# EAGLE design VC8Evrs (EAGLE 6.6.0)
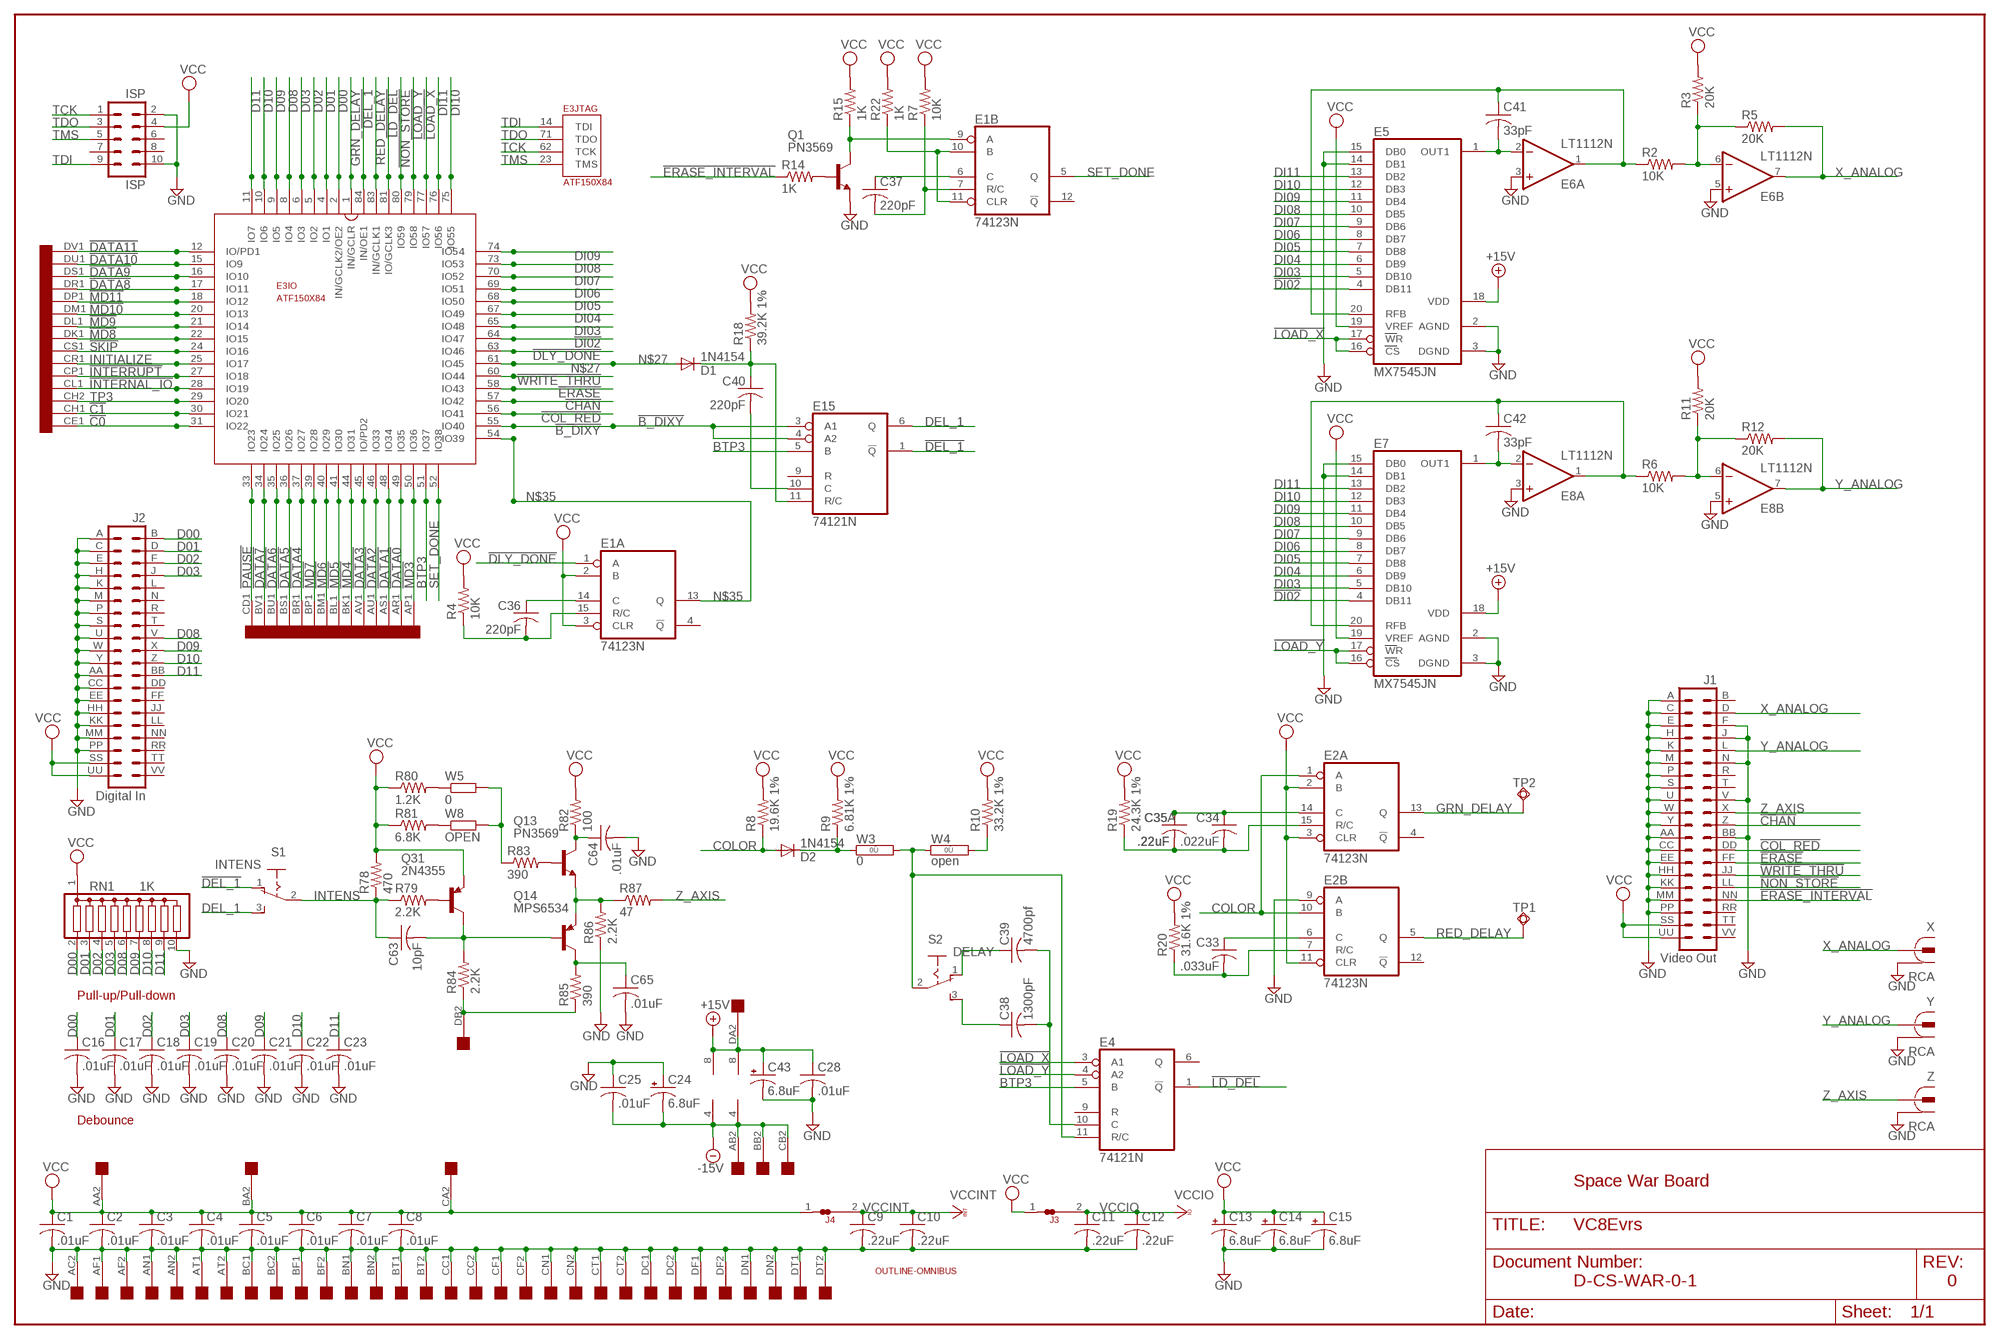
[diagram p0: schematic, sheet 1]

## Parts
C1  .01uF  C-US  [C063-025X075]
C2  .01uF  C-US  [C063-025X075]
C3  .01uF  C-US  [C063-025X075]
C4  .01uF  C-US  [C063-025X075]
C5  .01uF  C-US  [C063-025X075]
C6  .01uF  C-US  [C063-025X075]
C7  .01uF  C-US  [C063-025X075]
C8  .01uF  C-US  [C063-025X075]
C9  .22uF  C-US  [C063-025X075]
C10  .22uF  C-US  [C063-025X075]
C11  .22uF  C-US  [C063-025X075]
C12  .22uF  C-US  [C063-025X075]
C13  6.8uF  CPOL-USE20-8AXIAL  [E12-8]
C14  6.8uF  CPOL-USE20-8AXIAL  [E12-8]
C15  6.8uF  CPOL-USE20-8AXIAL  [E12-8]
C16  .01uF  C-US  [C063-025X075]
C17  .01uF  C-US  [C063-025X075]
C18  .01uF  C-US  [C063-025X075]
C19  .01uF  C-US  [C063-025X075]
C20  .01uF  C-US  [C063-025X075]
C21  .01uF  C-US  [C063-025X075]
C22  .01uF  C-US  [C063-025X075]
C23  .01uF  C-US  [C063-025X075]
C24  6.8uF  CPOL-USE20-8AXIAL  [E12-8]
C25  .01uF  C-US  [C063-025X075]
C28  .01uF  C-US  [C063-025X075]
C33  .033uF  C-US102-043X133  [C102-043X133]
C34  .022uF  C-US102-043X133  [C102-043X133]
C35  .22uF  C-US050-025X075  [C050-025X075]
C35A  .22uF  C-US102-043X133  [C102-043X133]
C36  220pF  C-US  [C063-025X075]
C37  220pF  C-US  [C063-025X075]
C38  1300pF  C-US150-054X183  [C150-054X183]
C39  4700pf  C-US102-043X133  [C102-043X133]
C40  220pF  C-US  [C063-025X075]
C41  33pF  C-US  [C063-025X075]
C42  33pF  C-US  [C063-025X075]
C43  6.8uF  CPOL-USE20-8AXIAL  [E12-8]
C63  10pF  C-US  [C063-025X075]
C64  .01uF  C-US  [C063-025X075]
C65  .01uF  C-US  [C063-025X075]
D1  1N4154  DIODE-DO35-10  [DO35-10]
D2  1N4154  DIODE-DO35-10  [DO35-10]
E1  74123N  [DIL16]
E2  74123N  [DIL16]
E3  ATF150X84  [S84]
E4  74121N  [DIL14]
E5  MX7545JN  [DIL20]
E6  LT1112N  LM1458N  [DIL08]
E7  MX7545JN  [DIL20]
E8  LT1112N  LM1458N  [DIL08]
E15  74121N  [DIL14]
ISP  ISP  ML10  [ML10]
J1  Video Out  DEC40PINH  [DEC40PINH]
J2  Digital In  DEC40PINH  [DEC40PINH]
J3  JUMPER-NC1  [NC1]
J4  JUMPER-NC1  [NC1]
OMNIBUS  QUAD  [EDGE-CON8]
Q1  PN3569  -NPN-TO18-  [TO18-]
Q13  PN3569  -NPN-TO5  [TO5]
Q14  MPS6534  -PNP-TO5  [TO5]
Q31  2N4355  -PNP-TO5  [TO5]
R2  10K  R-US_0207/10  [0207/10]
R3  20K  R-US_0207/10  [0207/10]
R4  10K  R-US_0207/10  [0207/10]
R5  20K  R-US_0207/10  [0207/10]
R6  10K  R-US_0207/10  [0207/10]
R7  10K  R-US_0207/10  [0207/10]
R8  19.6K 1%  R-US_0207/15  [0207/15]
R9  6.81K 1%  R-US_0207/15  [0207/15]
R10  33.2K 1%  R-US_0207/15  [0207/15]
R11  20K  R-US_0207/10  [0207/10]
R12  20K  R-US_0207/10  [0207/10]
R14  1K  R-US_0207/10  [0207/10]
R15  1K  R-US_0207/10  [0207/10]
R18  39.2K 1%  R-US_0207/15  [0207/15]
R19  24.3K 1%  R-US_0207/15  [0207/15]
R20  31.6K 1%  R-US_0207/15  [0207/15]
R22  1K  R-US_0207/10  [0207/10]
R78  470  R-US_0207/10  [0207/10]
R79  2.2K  R-US_0207/10  [0207/10]
R80  1.2K  R-US_0207/10  [0207/10]
R81  6.8K  R-US_0207/10  [0207/10]
R82  100  R-US_0207/10  [0207/10]
R83  390  R-US_0207/10  [0207/10]
R84  2.2K  R-US_0207/10  [0207/10]
R85  390  R-US_0207/10  [0207/10]
R86  2.2K  R-US_0207/10  [0207/10]
R87  47  R-US_0207/10  [0207/10]
RN1  1K  G09R  [SIL10]
S1  INTENS  M251  [M251]
S2  DELAY  M251  [M251]
TP1  TPSQPAD1-17  [P1-17]
TP2  TPSQPAD1-17  [P1-17]
U$1  OUTLINE-OMNIBUS  [OMNIBUS]
W3  0  0R  [0R/10]
W4  open  0R  [0R/10]
W5  0  R-EU_0207/10  [0207/10]
W8  OPEN  R-EU_0207/10  [0207/10]
X  RCA  [RCA]
Y  RCA  [RCA]
Z  RCA  [RCA]

## Nets
!B_DIXY: E3.55(IO:IO40) E15.3(A1) E15.4(A2)
!C0: E3.31(IO:IO22) OMNIBUS.CE1
!C1: E3.30(IO:IO21) OMNIBUS.CH1
!CHAN: E3.57(IO:IO42) J1.Z
!COL_RED: E3.56(IO:IO41) J1.DD
!DATA0: E3.49(IO:IO35) OMNIBUS.AR1
!DATA1: E3.48(IO:IO34) OMNIBUS.AS1
!DATA2: E3.46(IO:IO33) OMNIBUS.AU1
!DATA3: E3.45(IO:IO/PD2) OMNIBUS.AV1
!DATA4: E3.37(IO:IO27) OMNIBUS.BR1
!DATA5: E3.36(IO:IO26) OMNIBUS.BS1
!DATA6: E3.35(IO:IO25) OMNIBUS.BU1
!DATA7: E3.34(IO:IO24) OMNIBUS.BV1
!DATA8: E3.17(IO:IO11) OMNIBUS.DR1
!DATA9: E3.16(IO:IO10) OMNIBUS.DS1
!DATA10: E3.15(IO:IO9) OMNIBUS.DU1
!DATA11: E3.12(IO:IO/PD1) OMNIBUS.DV1
!DEL_1: E3.84(IO:IN/OE1) E15.1(!Q) S1.1(O)
!DI02: E3.64(IO:IO47) E5.4(DB11) E7.4(DB11)
!DLY_DONE: E1.1(A:A) E3.63(IO:IO46)
!ERASE: E3.58(IO:IO43) J1.FF
!ERASE_INTERVAL: J1.NN R14.1
!INTERNAL_IO: E3.28(IO:IO19) OMNIBUS.CL1
!INTERRUPT: E3.27(IO:IO18) OMNIBUS.CP1
!LD_DEL: E3.81(IO:IO/GCLK3) E4.1(!Q)
!LOAD_X: E3.77(IO:IO57) E4.3(A1) E5.16(CS) E5.17(WR)
!LOAD_Y: E3.79(IO:IO58) E4.4(A2) E7.16(CS) E7.17(WR)
!MD3: E3.50(IO:IO36) OMNIBUS.AP1
!MD4: E3.44(IO:IO31) OMNIBUS.BK1
!MD5: E3.41(IO:IO30) OMNIBUS.BL1
!MD6: E3.40(IO:IO29) OMNIBUS.BM1
!MD7: E3.39(IO:IO28) OMNIBUS.BP1
!MD8: E3.22(IO:IO15) OMNIBUS.DK1
!MD9: E3.21(IO:IO14) OMNIBUS.DL1
!MD10: E3.20(IO:IO13) OMNIBUS.DM1
!MD11: E3.18(IO:IO12) OMNIBUS.DP1
!NON_STORE: E3.80(IO:IO59) J1.LL
!PAUSE: E3.33(IO:IO23) OMNIBUS.CD1
!SKIP: E3.24(IO:IO16) OMNIBUS.CS1
!WRITE_THRU: E3.60(IO:IO44) J1.JJ
+15V: C28.1 C43.+ E5.18(VDD) E6.8(P:V+) E7.18(VDD) E8.8(P:V+) OMNIBUS.DA2
-15V [supply]: C24.- C25.2 E6.4(P:V-) E8.4(P:V-) OMNIBUS.AB2 OMNIBUS.BB2 OMNIBUS.CB2
BTP3: E3.51(IO:IO37) E4.5(B) E15.5(B)
COLOR: D2.A E2.1(A:A) E2.10(B:B) R8.1
D00: C16.1 E3.2(IO:IN/GCLK2/OE2) J2.B RN1.2
D01: C17.1 E3.4(IO:IO1) J2.D RN1.3
D02: C18.1 E3.5(IO:IO2) J2.F RN1.4
D03: C19.1 E3.6(IO:IO3) J2.J RN1.5
D08: C20.1 E3.8(IO:IO4) J2.V RN1.6
D09: C21.1 E3.9(IO:IO5) J2.X RN1.7
D10: C22.1 E3.10(IO:IO6) J2.Z RN1.8
D11: C23.1 E3.11(IO:IO7) J2.BB RN1.9
DEL_1: E15.6(Q) S1.3(S)
DI03: E3.65(IO:IO48) E5.5(DB10) E7.5(DB10)
DI04: E3.67(IO:IO49) E5.6(DB9) E7.6(DB9)
DI05: E3.68(IO:IO50) E5.7(DB8) E7.7(DB8)
DI06: E3.69(IO:IO51) E5.8(DB7) E7.8(DB7)
DI07: E3.70(IO:IO52) E5.9(DB6) E7.9(DB6)
DI08: E3.73(IO:IO53) E5.10(DB5) E7.10(DB5)
DI09: E3.74(IO:IO54) E5.11(DB4) E7.11(DB4)
DI10: E3.75(IO:IO55) E5.12(DB3) E7.12(DB3)
DI11: E3.76(IO:IO56) E5.13(DB2) E7.13(DB2)
GND [supply]: C1.2 C2.2 C3.2 C4.2 C5.2 C6.2 C7.2 C8.2 C9.2 C10.2 C11.2 C12.2 C13.- C14.- C15.- C16.2 C17.2 C18.2 C19.2 C20.2 C21.2 C22.2 C23.2 C24.+ C25.1 C28.2 C43.- C64.2 C65.2 E2.9(B:A) E5.2(AGND) E5.3(DGND) E5.14(DB1) E5.15(DB0) E6.3(A:+IN) E6.5(B:+IN) E7.2(AGND) E7.3(DGND) E7.14(DB1) E7.15(DB0) E8.3(A:+IN) E8.5(B:+IN) ISP.2 ISP.10 J1.A J1.AA J1.BB J1.C J1.CC J1.E J1.EE J1.F J1.H J1.HH J1.J J1.K J1.KK J1.M J1.MM J1.N J1.P J1.PP J1.S J1.U J1.V J1.W J1.Y J2.A J2.AA J2.C J2.CC J2.E J2.EE J2.H J2.HH J2.K J2.KK J2.M J2.MM J2.P J2.PP J2.S J2.U J2.W J2.Y OMNIBUS.AC2 OMNIBUS.AF1 OMNIBUS.AF2 OMNIBUS.AN1 OMNIBUS.AN2 OMNIBUS.AT1 OMNIBUS.AT2 OMNIBUS.BC1 OMNIBUS.BC2 OMNIBUS.BF1 OMNIBUS.BF2 OMNIBUS.BN1 OMNIBUS.BN2 OMNIBUS.BT1 OMNIBUS.BT2 OMNIBUS.CC1 OMNIBUS.CC2 OMNIBUS.CF1 OMNIBUS.CF2 OMNIBUS.CN1 OMNIBUS.CN2 OMNIBUS.CT1 OMNIBUS.CT2 OMNIBUS.DC1 OMNIBUS.DC2 OMNIBUS.DF1 OMNIBUS.DF2 OMNIBUS.DN1 OMNIBUS.DN2 OMNIBUS.DT1 OMNIBUS.DT2 Q1.1(E) R86.1 RN1.10 X.1 X.1@1 X.1@2 Y.1 Y.1@1 Y.1@2 Z.1 Z.1@1 Z.1@2
GRN_DELAY: E2.13(A:Q) E3.1(IO:IN/GCLR) TP2.TP
INITIALIZE: E3.25(IO:IO17) OMNIBUS.CR1
INTENS: C63.1 R78.1 R79.1 S1.2(P)
N$1: C41.2 E5.1(OUT1) E6.2(A:-IN)
N$2: E6.6(B:-IN) R2.2 R3.1 R5.1
N$3: C41.1 E5.20(RFB) E6.1(A:OUT) R2.1
N$4: C39.1 S2.1(O)
N$5: C42.2 E7.1(OUT1) E8.2(A:-IN)
N$6: E8.6(B:-IN) R6.2 R11.1 R12.1
N$7: C42.1 E7.20(RFB) E8.1(A:OUT) R6.1
N$27: D1.A E3.61(IO:IO45)
N$28: C40.1 D1.C E15.11(R/C) R18.1
N$29: C40.2 E15.10(C)
N$30: C34.2 C35.2 C35A.2 E2.15(A:R/C) R19.1
N$31: C33.2 E2.7(B:R/C) R20.1
N$32: C33.1 E2.6(B:C)
N$33: C34.1 C35.1 C35A.1 E2.14(A:C)
N$35: E1.13(A:Q) E3.54(IO:IO39)
N$36: C36.2 E1.15(A:R/C) R4.1
N$37: C36.1 E1.14(A:C)
N$38: Q1.2(B) R14.2
N$39: E1.9(B:A) Q1.3(C) R15.1
N$40: E1.10(B:B) E1.11(B:CLR) R22.1
N$41: C37.2 E1.7(B:R/C) R7.1
N$42: C37.1 E1.6(B:C)
N$44: D2.C R9.1 W3.1
N$45: E4.11(R/C) S2.2(P) W3.2 W4.1
N$46: R10.1 W4.2
N$48: C38.1 S2.3(S)
N$49: C38.2 C39.2 E4.10(C)
N$153: Q31.2(B) R79.2
N$154: C63.2 Q14.2(B) Q31.3(C) R84.2
N$155 [supply]: OMNIBUS.DB2 R84.1 R85.1
N$156: C65.1 Q14.3(C) R85.2
N$157: Q13.1(E) Q14.1(E) R86.2 R87.1
N$158: R80.2 W5.1
N$159: R81.2 W8.1
N$160: Q13.2(B) R83.2
N$161: R83.1 W5.2 W8.2
N$162: C64.1 Q13.3(C) R82.1
RED_DELAY: E2.5(B:Q) E3.83(IO:IN/GCLK1) TP1.TP
SET_DONE: E1.5(B:Q) E3.52(IO:IO38)
TCK: E3.62(JTAG:TCK) ISP.1
TDI: E3.14(JTAG:TDI) ISP.9
TDO: E3.71(JTAG:TDO) ISP.3
TMS: E3.23(JTAG:TMS) ISP.5
TP3: E3.29(IO:IO20) OMNIBUS.CH2
VCC [supply]: C1.1 C2.1 C3.1 C4.1 C5.1 C6.1 C7.1 C8.1 C13.+ C14.+ C15.+ E1.2(A:B) E1.3(A:CLR) E2.2(A:B) E2.3(A:CLR) E2.11(B:CLR) E5.19(VREF) E7.19(VREF) ISP.4 J1.SS J1.UU J2.SS J2.UU J3.1 J4.1 OMNIBUS.AA2 OMNIBUS.BA2 OMNIBUS.CA2 Q31.1(E) R3.2 R4.2 R7.2 R8.2 R9.2 R10.2 R11.2 R15.2 R18.2 R19.2 R20.2 R22.2 R78.2 R80.1 R81.1 R82.2 RN1.1
VCCINT [supply]: C9.1 C10.1 J4.2
VCCIO [supply]: C11.1 C12.1 J3.2
X_ANALOG: E6.7(B:OUT) J1.D R5.2 X.2
Y_ANALOG: E8.7(B:OUT) J1.L R12.2 Y.2
Z_AXIS: J1.X R87.2 Z.2
Unconnected: E1.4(A:!Q) E1.12(B:!Q) E2.4(A:!Q) E2.12(B:!Q) E4.6(Q) E4.9(R) E15.9(R) ISP.6 ISP.7 ISP.8 J1.B J1.R J1.RR J1.T J1.TT J1.VV J2.DD J2.FF J2.JJ J2.L J2.LL J2.N J2.NN J2.R J2.RR J2.T J2.TT J2.VV OMNIBUS.AA1 OMNIBUS.AB1 OMNIBUS.AC1 OMNIBUS.AD1 OMNIBUS.AD2 OMNIBUS.AE1 OMNIBUS.AE2 OMNIBUS.AH1 OMNIBUS.AH2 OMNIBUS.AJ1 OMNIBUS.AJ2 OMNIBUS.AK1 OMNIBUS.AK2 OMNIBUS.AL1 OMNIBUS.AL2 OMNIBUS.AM1 OMNIBUS.AM2 OMNIBUS.AP2 OMNIBUS.AR2 OMNIBUS.AS2 OMNIBUS.AU2 OMNIBUS.AV2 OMNIBUS.BA1 OMNIBUS.BB1 OMNIBUS.BD1 OMNIBUS.BD2 OMNIBUS.BE1 OMNIBUS.BE2 OMNIBUS.BH1 OMNIBUS.BH2 OMNIBUS.BJ1 OMNIBUS.BJ2 OMNIBUS.BK2 OMNIBUS.BL2 OMNIBUS.BM2 OMNIBUS.BP2 OMNIBUS.BR2 OMNIBUS.BS2 OMNIBUS.BU2 OMNIBUS.BV2 OMNIBUS.CA1 OMNIBUS.CB1 OMNIBUS.CD2 OMNIBUS.CE2 OMNIBUS.CJ1 OMNIBUS.CJ2 OMNIBUS.CK1 OMNIBUS.CK2 OMNIBUS.CL2 OMNIBUS.CM1 OMNIBUS.CM2 OMNIBUS.CP2 OMNIBUS.CR2 OMNIBUS.CS2 OMNIBUS.CU1 OMNIBUS.CU2 OMNIBUS.CV1 OMNIBUS.CV2 OMNIBUS.DA1 OMNIBUS.DB1 OMNIBUS.DD1 OMNIBUS.DD2 OMNIBUS.DE1 OMNIBUS.DE2 OMNIBUS.DH1 OMNIBUS.DH2 OMNIBUS.DJ1 OMNIBUS.DJ2 OMNIBUS.DK2 OMNIBUS.DL2 OMNIBUS.DM2 OMNIBUS.DP2 OMNIBUS.DR2 OMNIBUS.DS2 OMNIBUS.DU2 OMNIBUS.DV2

## Notes on the sheet
- Pull-up/Pull-down
- Debounce
- Space War Board
- D-CS-WAR-0-1 | 0

## Power pins joined to a net without a drawn wire
GND: E1.8(P:GND) E2.8(P:GND) E3.7(GND) E3.19(GND) E3.32(GND) E3.42(GND) E3.47(GND) E3.59(GND) E3.72(GND) E3.82(GND) E4.7(GND) E15.7(GND)
VCC: E1.16(P:VCC) E2.16(P:VCC) E4.14(VCC) E15.14(VCC)
VCCINT: E3.3(VCCINT) E3.43(VCCINT)
VCCIO: E3.13(VCCIO) E3.26(VCCIO) E3.38(VCCIO) E3.53(VCCIO) E3.66(VCCIO) E3.78(VCCIO)

## Library data of the parts
C1-C12 C16-C23 C25 C28 C36 C37 C40-C42 C63-C65 = dec-con:C-US: Capacitors with funky DEC lead spacing.
C13-C15 C24 C43 = dec-con:CPOL-USE20-8AXIAL: A 0.8 inch electrolytic.
C33-C35 C35A C38 C39 = rcl:C-US: CAPACITOR, American symbol
D1 D2 = diode:DIODE-: DIODE
E1 E2 = 74xx-us:74*123: Retriggerable monostable MULTIVIBRATOR
E3 = atmel-cpld:ATF150X84: ATF150x in 84 pin package.
E4 E15 = 74xx-us:74*121: Monostable MULTIVIBRATOR, schmitt trigger inputs
E5 E7 = maxim:MX7545JN: DIGITAL/ANALOG CONVERTER; MPN: MX7545JN+; OC_FARNELL: unknown; OC_NEWARK: 61K1015
E6 E8 = linear:*1458: OP AMP
ISP = con-harting-ml:ML10: HARTING; OC_FARNELL: unknown; OC_NEWARK: unknown
J1 J2 = dec-con:DEC40PIN: PIN HEADER
J3 J4 = dec-con:JUMPER: Normally closed SMD Jumper (Generates a DRC error.)
OMNIBUS = dec-con:QUAD: Quad-Height DEC board
Q1 Q13 = transistor:*-NPN-: NPN Transistror BF959 corrected 2008.03.06
Q14 Q31 = transistor:*-PNP-: PNP Transistror
R2-R12 R14 R15 R18-R20 R22 R78-R87 = rcl:R-US_: RESISTOR, American symbol
RN1 = resistor-sil:G09R: SIL RESISTOR; OC_FARNELL: unknown; OC_NEWARK: unknown
S1 S2 = switch:M251: SLIDING SWITCH Mors, distributor Buerklin, 11G702
TP1 TP2 = testpad:TPSQ: Test pad
U$1 = dec-con:OUTLINE-*: Board outlines for DEC boards.
W3 W4 = jumper:0R: Bridge 0R 10mm
W5 W8 = rcl:R-EU_: RESISTOR, European symbol
X Y Z = dec-con:RCA: RCA Jack

## Net classes
1 supply: width 0.686 mm

## Board
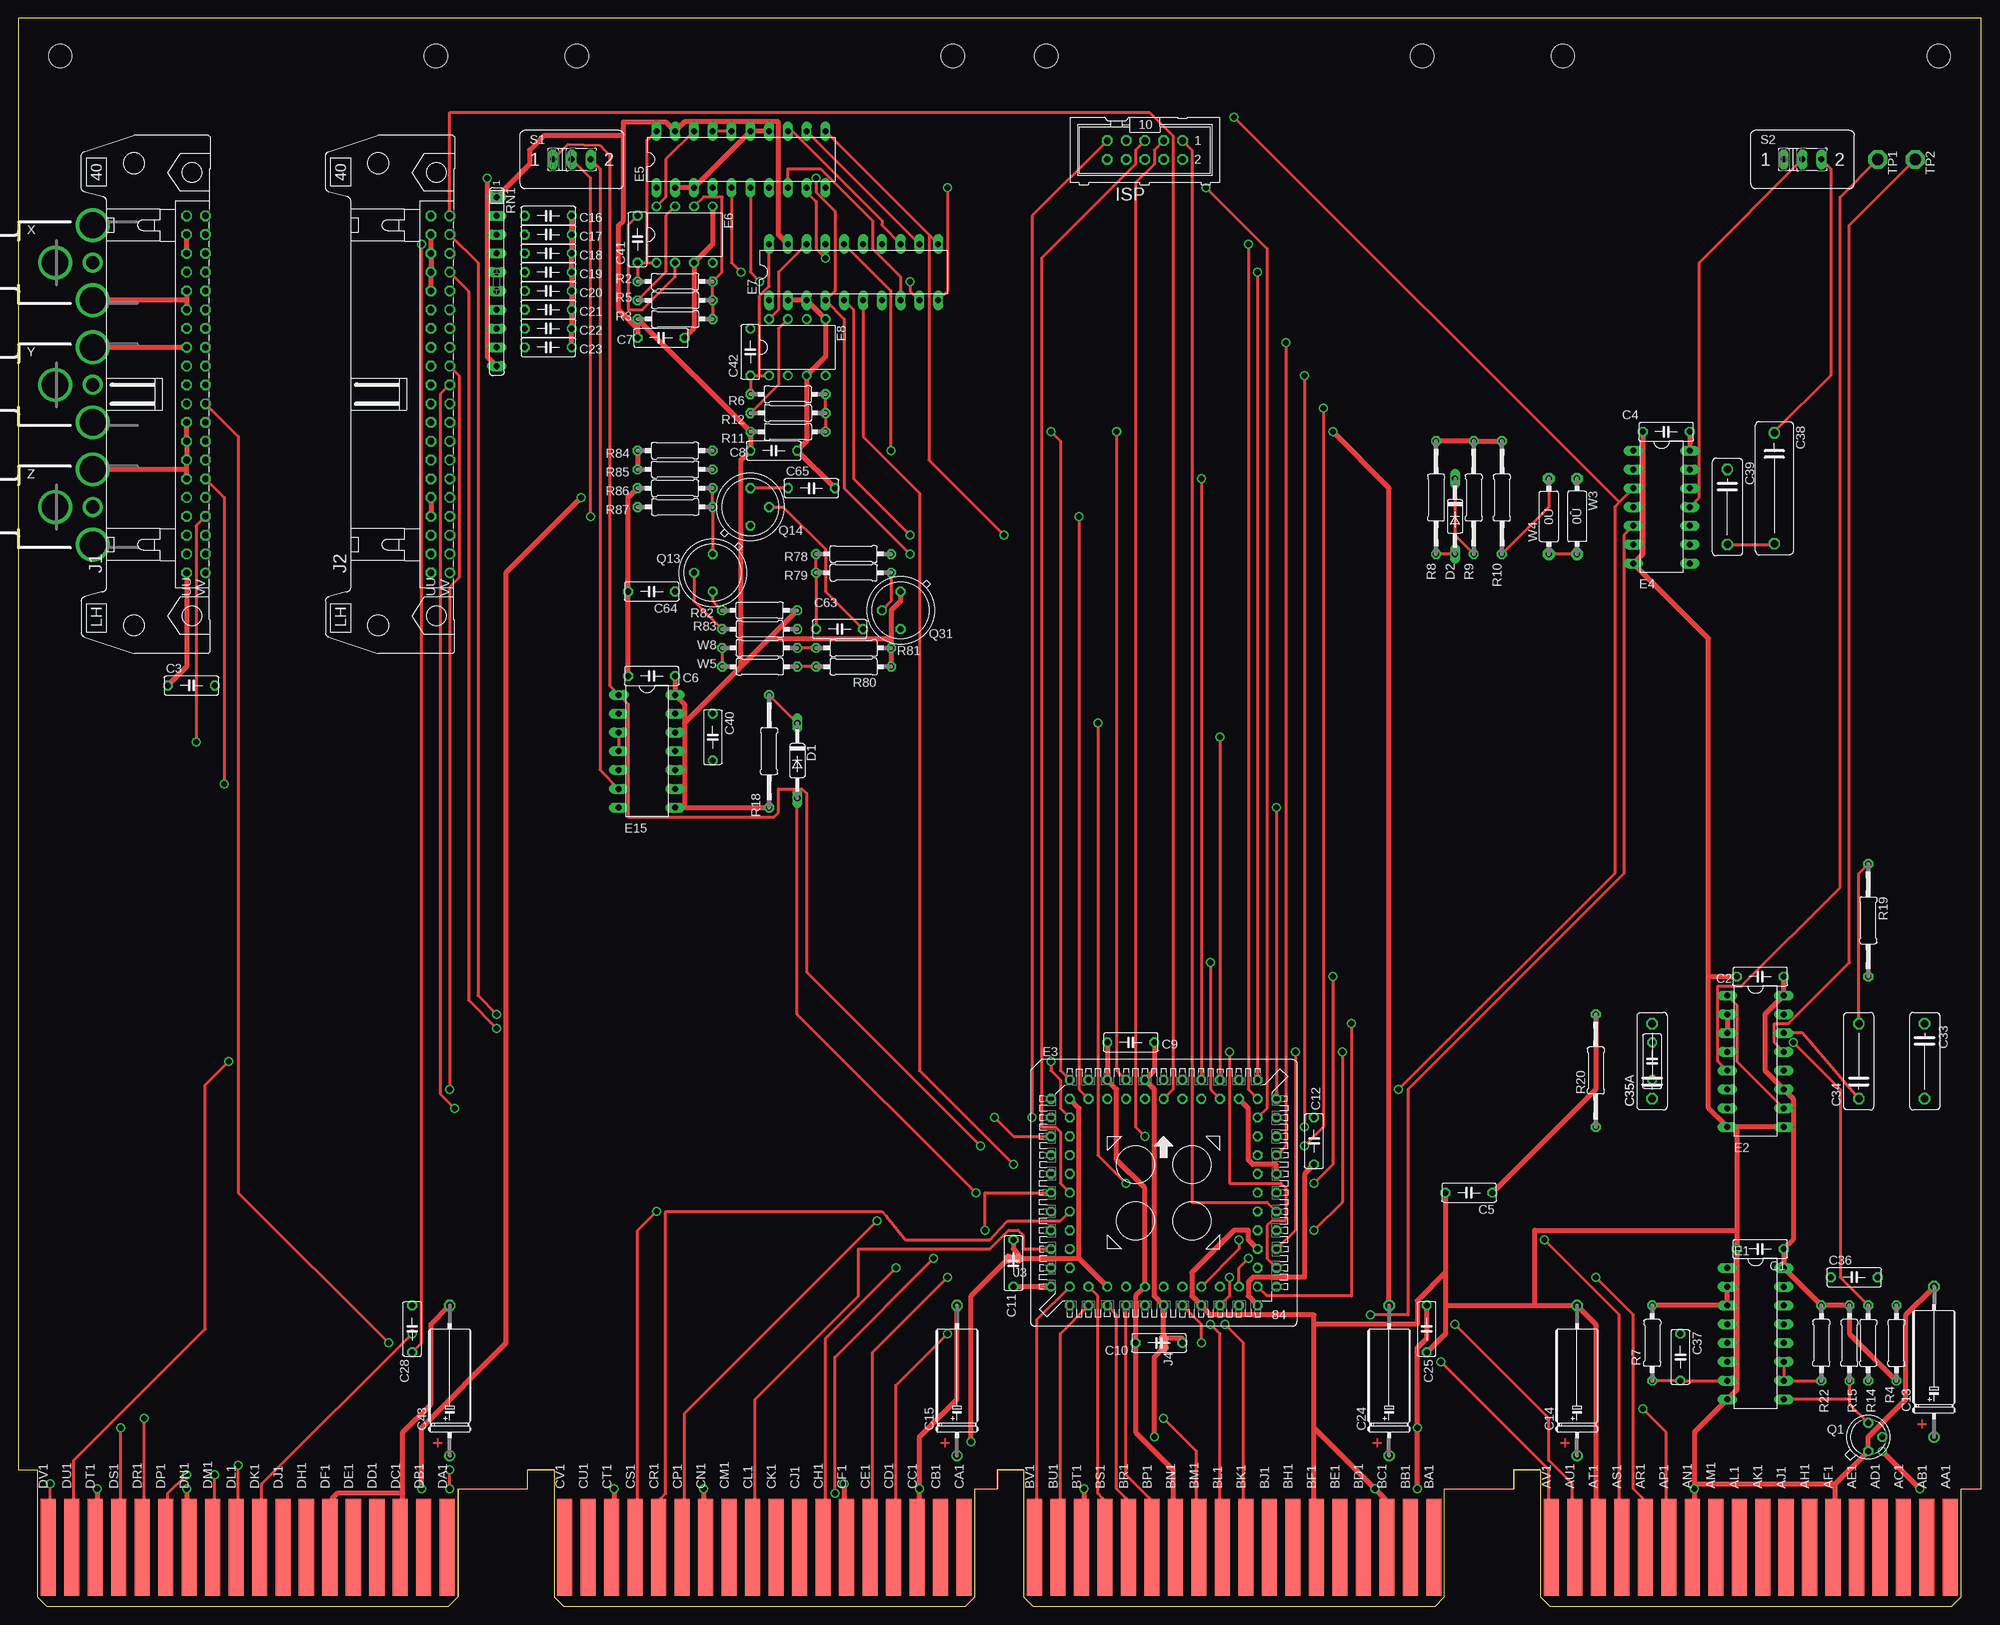
[diagram p1: board, top side]
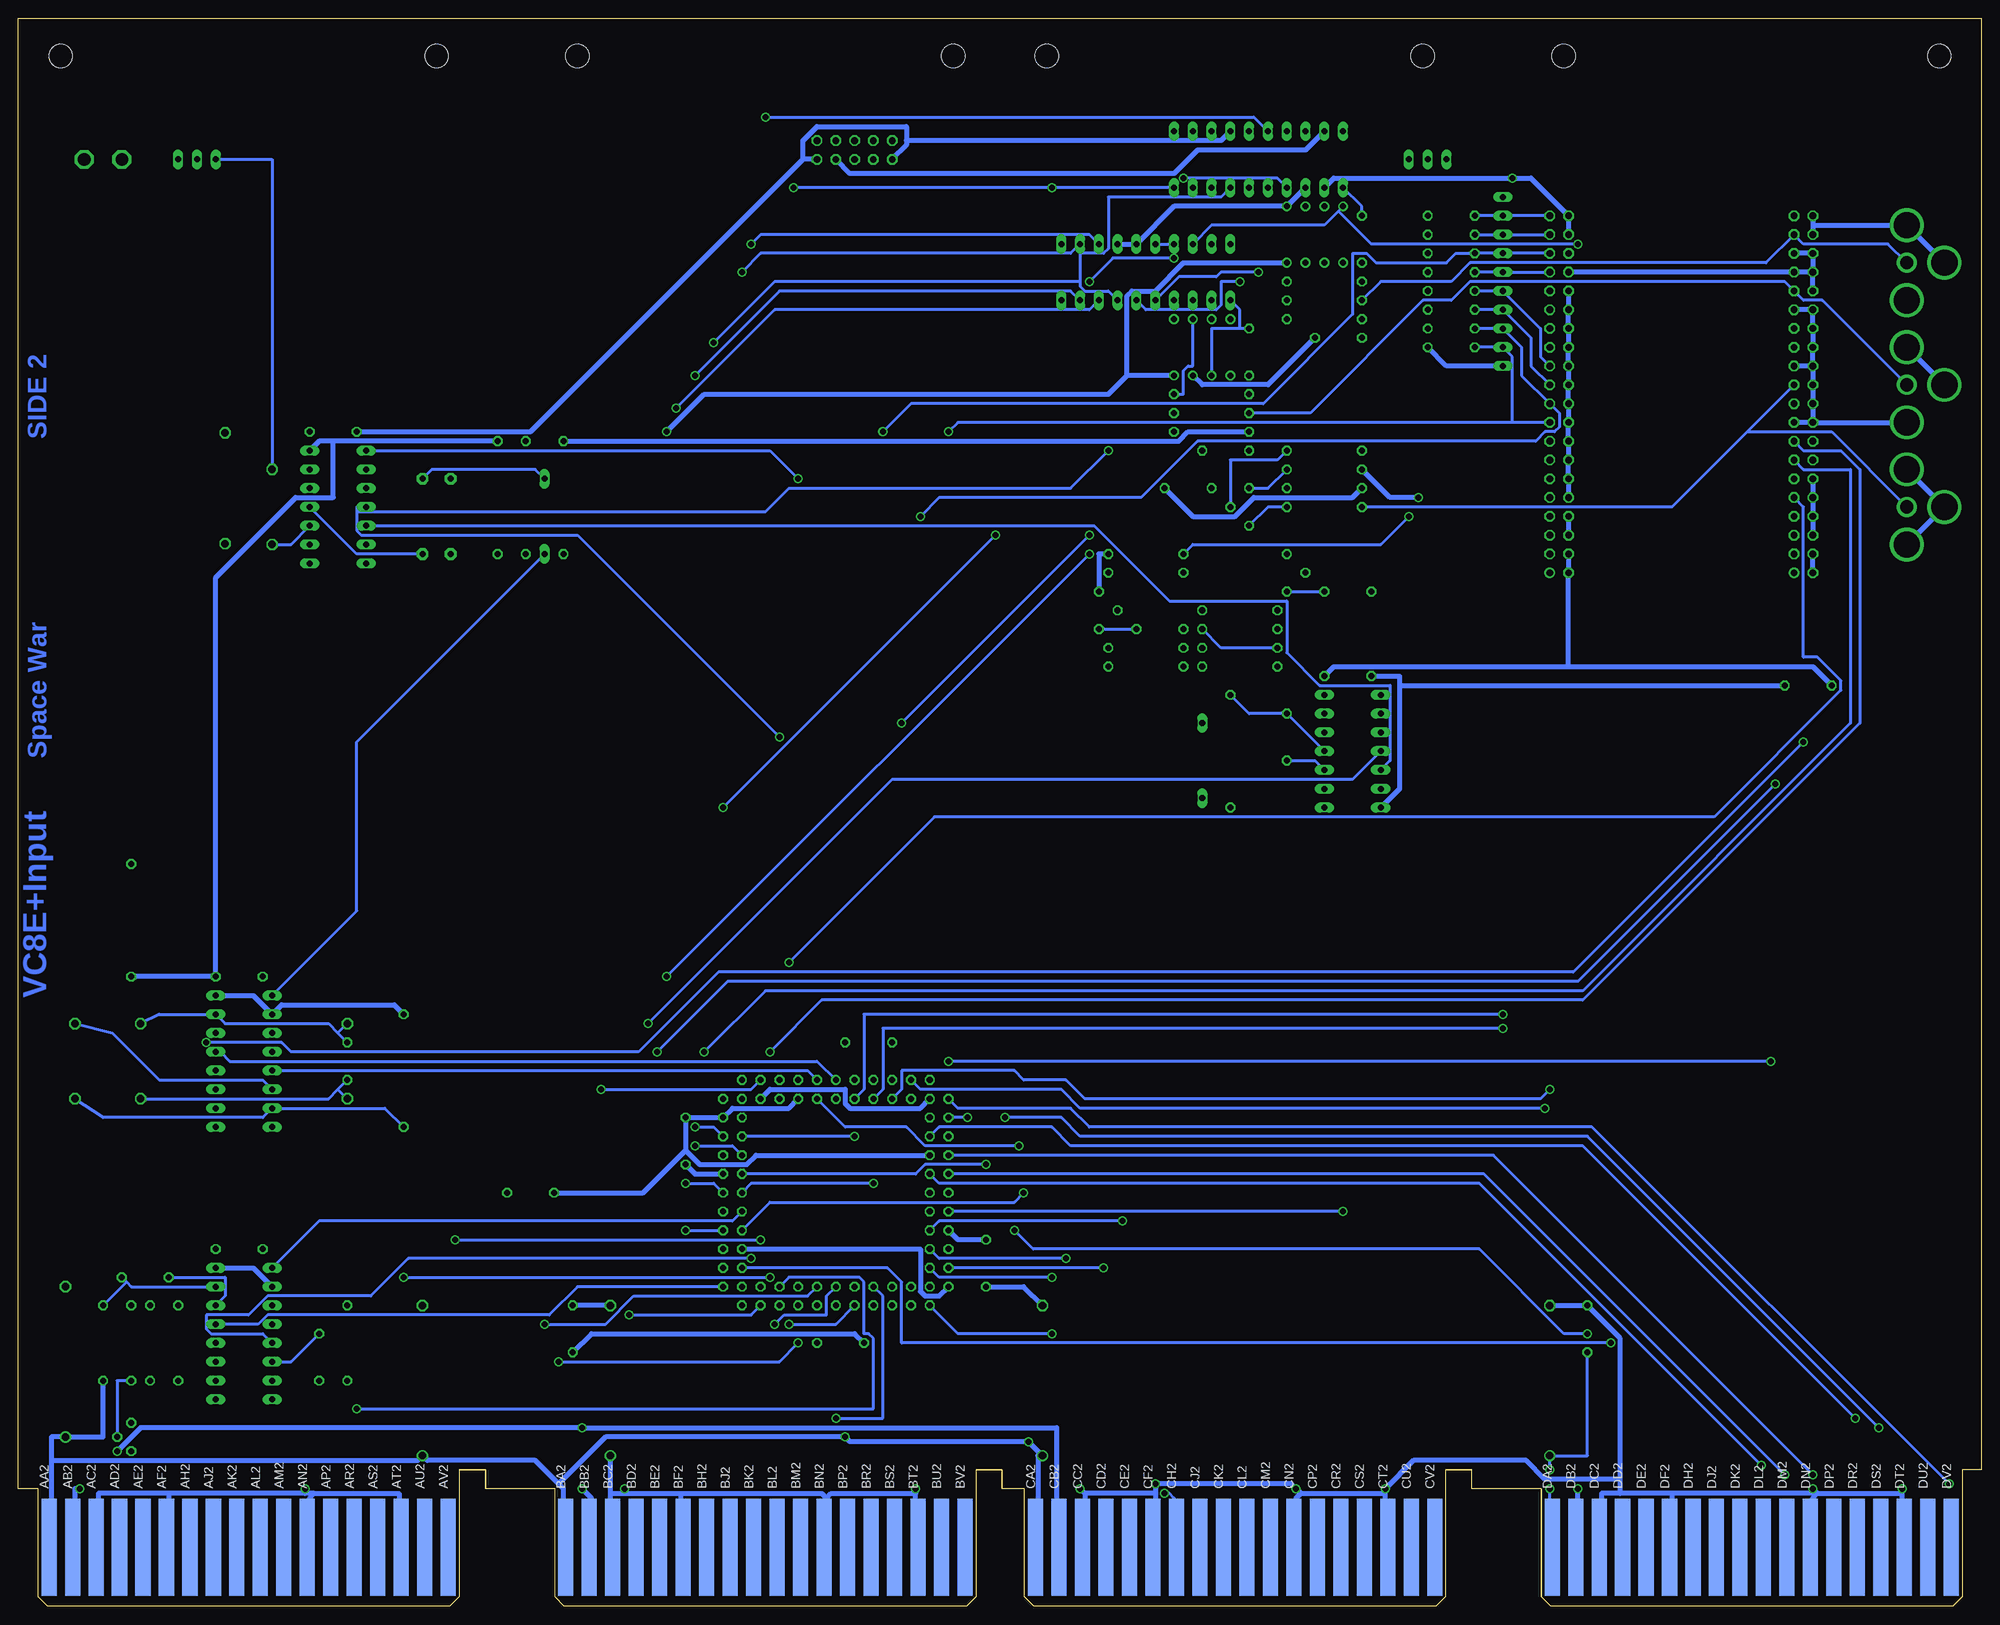
[diagram p2: board, bottom side, seen from below]

Size 265.3 x 214.63 mm. Coordinates in mm from the lower left corner, seen from the top.
Copper layers (1+2+15+16): Top 0.035mm / dielectric 1.5mm / ECO1 0.035mm / dielectric 0.15mm / ECO2 0.035mm / dielectric 0.2mm / Bottom 0.035mm
Design rules "16mils *": minimum track width 16mil, minimum drill 32mil, track to track 12.5mil, track to pad 10mil, pad to pad 10mil, via to via 10mil, smd to smd 10mil, copper to edge 13mil, drill to drill 10mil, minimum pad ring 10mil, minimum via ring 8mil, stop-mask expansion 0mil, vias tented up to drill 0mil, thermal gap 10mil

### Footprints (pad centres in the part's own frame; a part is rotated, then mirrored left to right if it is on the bottom)
C063-025X075 = drill 0.813 octagon: 1 -2.54,0; 2 3.81,0
E12-8 = drill 1.016: + -10.16,0 | drill 1.016 octagon: - 10.16,0
C102-043X133 = drill 1.016 octagon: 1 -5.08,0; 2 5.08,0
C050-025X075 = drill 0.813 octagon: 1 -2.54,0; 2 2.54,0
C150-054X183 = drill 1.016 octagon: 1 -7.493,0; 2 7.493,0
DO35-10 = drill 0.813 long: A 5.08,0; C -5.08,0
DIL16 = drill 0.813 long: 1 -8.89,-3.81; 2 -6.35,-3.81; 3 -3.81,-3.81; 4 -1.27,-3.81; 5 1.27,-3.81; 6 3.81,-3.81; 7 6.35,-3.81; 8 8.89,-3.81; 9 8.89,3.81; 10 6.35,3.81; 11 3.81,3.81; 12 1.27,3.81; 13 -1.27,3.81; 14 -3.81,3.81; 15 -6.35,3.81; 16 -8.89,3.81
S84 = drill 0.813: 1 0,15.24 | drill 0.813 octagon: 2 0,12.7; 3 -2.54,15.24; 4 -2.54,12.7; 5 -5.08,15.24; 6 -5.08,12.7; 7 -7.62,15.24; 8 -7.62,12.7; 9 -10.16,15.24; 10 -10.16,12.7; 11 -12.7,15.24; 12 -15.24,12.7; 13 -12.7,12.7; 14 -15.24,10.16; 15 -12.7,10.16; 16 -15.24,7.62; 17 -12.7,7.62; 18 -15.24,5.08; 19 -12.7,5.08; 20 -15.24,2.54; 21 -12.7,2.54; 22 -15.24,0; 23 -12.7,0; 24 -15.24,-2.54; 25 -12.7,-2.54; 26 -15.24,-5.08; 27 -12.7,-5.08; 28 -15.24,-7.62; 29 -12.7,-7.62; 30 -15.24,-10.16; 31 -12.7,-10.16; 32 -15.24,-12.7; 33 -12.7,-15.24; 34 -12.7,-12.7; 35 -10.16,-15.24; 36 -10.16,-12.7; 37 -7.62,-15.24; 38 -7.62,-12.7; 39 -5.08,-15.24; 40 -5.08,-12.7; 41 -2.54,-15.24; 42 -2.54,-12.7; 43 0,-15.24; 44 0,-12.7; 45 2.54,-15.24; 46 2.54,-12.7; 47 5.08,-15.24; 48 5.08,-12.7; 49 7.62,-15.24; 50 7.62,-12.7; 51 10.16,-15.24; 52 10.16,-12.7; 53 12.7,-15.24; 54 15.24,-12.7; 55 12.7,-12.7; 56 15.24,-10.16; 57 12.7,-10.16; 58 15.24,-7.62; 59 12.7,-7.62; 60 15.24,-5.08; 61 12.7,-5.08; 62 15.24,-2.54; 63 12.7,-2.54; 64 15.24,0; 65 12.7,0; 66 15.24,2.54; 67 12.7,2.54; 68 15.24,5.08; 69 12.7,5.08; 70 15.24,7.62; 71 12.7,7.62; 72 15.24,10.16; 73 12.7,10.16; 74 15.24,12.7; 75 12.7,15.24; 76 12.7,12.7; 77 10.16,15.24; 78 10.16,12.7; 79 7.62,15.24; 80 7.62,12.7; 81 5.08,15.24; 82 5.08,12.7; 83 2.54,15.24; 84 2.54,12.7
DIL14 = drill 0.813 long: 1 -7.62,-3.81; 2 -5.08,-3.81; 3 -2.54,-3.81; 4 0,-3.81; 5 2.54,-3.81; 6 5.08,-3.81; 7 7.62,-3.81; 8 7.62,3.81; 9 5.08,3.81; 10 2.54,3.81; 11 0,3.81; 12 -2.54,3.81; 13 -5.08,3.81; 14 -7.62,3.81
DIL20 = drill 0.813 long: 1 -11.43,-3.81; 2 -8.89,-3.81; 3 -6.35,-3.81; 4 -3.81,-3.81; 5 -1.27,-3.81; 6 1.27,-3.81; 7 3.81,-3.81; 8 6.35,-3.81; 9 8.89,-3.81; 10 11.43,-3.81; 11 11.43,3.81; 12 8.89,3.81; 13 6.35,3.81; 14 3.81,3.81; 15 1.27,3.81; 16 -1.27,3.81; 17 -3.81,3.81; 18 -6.35,3.81; 19 -8.89,3.81; 20 -11.43,3.81
DIL08 = drill 0.813 pad 1.27: 1 -3.81,-3.81; 2 -1.27,-3.81; 3 1.27,-3.81; 4 3.81,-3.81; 5 3.81,3.81; 6 1.27,3.81; 7 -1.27,3.81; 8 -3.81,3.81
ML10 = drill 0.914 octagon: 1 -5.08,-1.27; 2 -5.08,1.27; 3 -2.54,-1.27; 4 -2.54,1.27; 5 0,-1.27; 6 0,1.27; 7 2.54,-1.27; 8 2.54,1.27; 9 5.08,-1.27; 10 5.08,1.27
DEC40PINH = drill 0.914 octagon: A 24.13,1.27; AA -3.81,1.27; B 24.13,-1.27; BB -3.81,-1.27; C 21.59,1.27; CC -6.35,1.27; D 21.59,-1.27; DD -6.35,-1.27; E 19.05,1.27; EE -8.89,1.27; F 19.05,-1.27; FF -8.89,-1.27; H 16.51,1.27; HH -11.43,1.27; J 16.51,-1.27; JJ -11.43,-1.27; K 13.97,1.27; KK -13.97,1.27; L 13.97,-1.27; LL -13.97,-1.27; M 11.43,1.27; MM -16.51,1.27; N 11.43,-1.27; NN -16.51,-1.27; P 8.89,1.27; PP -19.05,1.27; R 8.89,-1.27; RR -19.05,-1.27; S 6.35,1.27; SS -21.59,1.27; T 6.35,-1.27; TT -21.59,-1.27; U 3.81,1.27; UU -24.13,1.27; V 3.81,-1.27; W 1.27,1.27; X 1.27,-1.27; Y -1.27,1.27; Z -1.27,-1.27 | drill 0.914: VV -24.13,-1.27
NC1 = smd 1.346 x 1.346: 1 -0.635,0; 2 0.635,0
EDGE-CON8 = smd 2.032 x 13.106: AA1 261.303,7.938; AB1 258.127,7.938; AC1 254.952,7.938; AD1 251.778,7.938; AE1 248.602,7.938; AF1 245.428,7.938; AH1 242.252,7.938; AJ1 239.077,7.938; AK1 235.903,7.938; AL1 232.727,7.938; AM1 229.553,7.938; AN1 226.377,7.938; AP1 223.202,7.938; AR1 220.028,7.938; AS1 216.852,7.938; AT1 213.678,7.938; AU1 210.502,7.938; AV1 207.327,7.938; BA1 191.452,7.938; BB1 188.278,7.938; BC1 185.102,7.938; BD1 181.928,7.938; BE1 178.752,7.938; BF1 175.577,7.938; BH1 172.403,7.938; BJ1 169.227,7.938; BK1 166.053,7.938; BL1 162.877,7.938; BM1 159.702,7.938; BN1 156.528,7.938; BP1 153.352,7.938; BR1 150.178,7.938; BS1 147.002,7.938; BT1 143.827,7.938; BU1 140.653,7.938; BV1 137.477,7.938; CA1 127.953,7.938; CB1 124.778,7.938; CC1 121.603,7.938; CD1 118.427,7.938; CE1 115.252,7.938; CF1 112.078,7.938; CH1 108.903,7.938; CJ1 105.728,7.938; CK1 102.552,7.938; CL1 99.377,7.938; CM1 96.203,7.938; CN1 93.028,7.938; CP1 89.853,7.938; CR1 86.677,7.938; CS1 83.502,7.938; CT1 80.328,7.938; CU1 77.153,7.938; CV1 73.978,7.938; DA1 58.102,7.938; DB1 54.928,7.938; DC1 51.752,7.938; DD1 48.578,7.938; DE1 45.403,7.938; DF1 42.227,7.938; DH1 39.053,7.938; DJ1 35.877,7.938; DK1 32.703,7.938; DL1 29.527,7.938; DM1 26.352,7.938; DN1 23.177,7.938; DP1 20.003,7.938; DR1 16.828,7.938; DS1 13.652,7.938; DT1 10.477,7.938; DU1 7.303,7.938; DV1 4.128,7.938 | smd 2.032 x 13.106 bottom: AA2 261.303,7.938; AB2 258.127,7.938; AC2 254.952,7.938; AD2 251.778,7.938; AE2 248.602,7.938; AF2 245.428,7.938; AH2 242.252,7.938; AJ2 239.077,7.938; AK2 235.903,7.938; AL2 232.727,7.938; AM2 229.553,7.938; AN2 226.377,7.938; AP2 223.202,7.938; AR2 220.028,7.938; AS2 216.852,7.938; AT2 213.678,7.938; AU2 210.502,7.938; AV2 207.327,7.938; BA2 191.452,7.938; BB2 188.278,7.938; BC2 185.102,7.938; BD2 181.928,7.938; BE2 178.752,7.938; BF2 175.577,7.938; BH2 172.403,7.938; BJ2 169.227,7.938; BK2 166.053,7.938; BL2 162.877,7.938; BM2 159.702,7.938; BN2 156.528,7.938; BP2 153.352,7.938; BR2 150.178,7.938; BS2 147.002,7.938; BT2 143.827,7.938; BU2 140.653,7.938; BV2 137.477,7.938; CA2 127.953,7.938; CB2 124.778,7.938; CC2 121.603,7.938; CD2 118.427,7.938; CE2 115.252,7.938; CF2 112.078,7.938; CH2 108.903,7.938; CJ2 105.728,7.938; CK2 102.552,7.938; CL2 99.377,7.938; CM2 96.203,7.938; CN2 93.028,7.938; CP2 89.853,7.938; CR2 86.677,7.938; CS2 83.502,7.938; CT2 80.328,7.938; CU2 77.153,7.938; CV2 73.978,7.938; DA2 58.102,7.938; DB2 54.928,7.938; DC2 51.752,7.938; DD2 48.578,7.938; DE2 45.403,7.938; DF2 42.227,7.938; DH2 39.053,7.938; DJ2 35.877,7.938; DK2 32.703,7.938; DL2 29.527,7.938; DM2 26.352,7.938; DN2 23.177,7.938; DP2 20.003,7.938; DR2 16.828,7.938; DS2 13.652,7.938; DT2 10.477,7.938; DU2 7.303,7.938; DV2 4.128,7.938
TO18- = drill 0.813 octagon: 1 1.905,0; 2 0,1.905; 3 -1.905,0
TO5 = drill 0.813 octagon: 1 0,-2.54; 2 2.54,0; 3 0,2.54
0207/10 = drill 0.813 octagon: 1 -5.08,0; 2 5.08,0
0207/15 = drill 0.813 octagon: 1 -7.62,0; 2 7.62,0
SIL10 = drill 0.813 long: 1 -11.43,0; 2 -8.89,0; 3 -6.35,0; 4 -3.81,0; 5 -1.27,0; 6 1.27,0; 7 3.81,0; 8 6.35,0; 9 8.89,0; 10 11.43,0
M251 = drill 0.813 long: 1 -2.54,0; 2 0,0; 3 2.54,0
P1-17 = drill 1.702 pad 2.54 octagon: TP 0,0
OMNIBUS = hole 3.175: 208.915,209.55; 259.715,209.55; 189.865,209.55; 139.065,209.55; 75.616,209.55; 126.416,209.55; 56.566,209.55; 5.766,209.55
0R/10 = drill 0.813 pad 1.6 octagon: 1 -5.08,0; 2 5.08,0
RCA = drill 3.556: 1 -5.08,0; 1@1 0,-5.08; 1@2 0,5.08 | drill 1.8: 2 0,0

### Placement (x,y rotation side)
C1  236.09,48.26 180 top
C2  236.09,85.09 180 top
C3  22.73,124.46 0 top
C4  223.39,158.75 180 top
C5  196.72,55.88 180 top
C6  86.23,125.73 180 top
C7  86.23,171.45 0 top
C8  101.47,156.21 0 top
C9  151,76.2 180 top
C10  154.81,35.56 180 top
C11  134.49,46.99 270 top
C12  175.13,62.23 90 top
C13  258.95,33.02 90 top
C14  210.69,30.48 90 top
C15  126.87,30.48 90 top
C16  70.99,187.96 0 top
C17  70.99,185.42 0 top
C18  70.99,182.88 0 top
C19  70.99,180.34 0 top
C20  70.99,177.8 0 top
C21  70.99,175.26 0 top
C22  70.99,172.72 0 top
C23  70.99,170.18 0 top
C24  185.29,30.48 90 top
C25  190.37,36.83 90 top
C28  53.21,36.83 90 top
C33  257.68,73.66 270 top
C34  248.79,73.66 90 top
C35  220.85,73.66 90 top
C35A  220.85,73.66 90 top
C36  247.52,44.45 0 top
C37  224.66,34.29 270 top
C38  237.36,151.13 270 top
C39  231.01,148.59 270 top
C40  93.85,118.11 270 top
C41  83.69,184.15 90 top
C42  98.93,168.91 90 top
C43  58.29,30.48 90 top
C63  110.36,132.08 0 top
C64  86.23,137.16 180 top
C65  106.55,151.13 0 top
D1  105.28,114.3 270 top
D2  194.18,147.32 270 top
E1  234.82,36.83 270 top
E2  234.82,73.66 270 top
E3  154.81,55.88 0 top
E4  222.12,148.59 270 top
E5  97.66,195.58 0 top
E6  90.04,185.42 0 top
E7  112.9,180.34 0 top
E8  105.28,170.18 0 top
E15  84.96,115.57 270 top
ISP  152.27,196.85 180 top
J1  24,163.83 90 top
J2  57.02,163.83 90 top
J3  134.49,46.99 0 top
J4  154.81,35.56 90 top
OMNIBUS  -0.13,0 0 top
Q1  250.06,22.86 270 top
Q13  93.85,139.7 180 top
Q14  98.93,148.59 0 top
Q31  119.25,134.62 180 top
R2  88.77,179.07 0 top
R3  88.77,173.99 180 top
R4  253.87,35.56 270 top
R5  88.77,176.53 180 top
R6  104.01,163.83 0 top
R7  220.85,35.56 90 top
R8  191.64,149.86 90 top
R9  196.72,149.86 90 top
R10  200.53,149.86 90 top
R11  104.01,158.75 180 top
R12  104.01,161.29 180 top
R14  250.06,35.56 270 top
R15  247.52,35.56 90 top
R18  101.47,115.57 270 top
R19  250.06,92.71 270 top
R20  213.23,72.39 90 top
R22  243.71,35.56 90 top
R78  112.9,142.24 0 top
R79  112.9,139.7 0 top
R80  112.9,127 180 top
R81  112.9,129.54 180 top
R82  100.2,134.62 0 top
R83  100.2,132.08 180 top
R84  88.77,156.21 0 top
R85  88.77,153.67 0 top
R86  88.77,151.13 0 top
R87  88.77,148.59 180 top
RN1  64.64,179.07 270 top
S1  74.8,195.58 0 top
S2  241.17,195.58 0 top
TP1  251.33,195.58 270 top
TP2  256.41,195.58 270 top
U$1  -0.13,0 0 top
W3  210.69,147.32 270 top
W4  206.88,147.32 90 top
W5  100.2,127 180 top
W8  100.2,129.54 180 top
X  10.03,181.61 0 top
Y  10.03,165.1 0 top
Z  10.03,148.59 0 top

### Tracks (layer width: path | path; a pad name or v marks a point on that pad's centre or on a via)
!B_DIXY  (via drill 0.81)
  Top 0.406: E15.3 E15.4 | E3.55 168.78,41.91 180.21,41.91 v180.21,78.74
  Bottom 0.406: v180.21,78.74 147.19,111.76 84.96,111.76 E15.4
!C0  (via drill 0.81)
  Top 0.406: v125.6,44.45 115.44,34.29 115.44,8.26 OMNIBUS.CE1
  Bottom 0.406: E3.31 140.84,44.45 v125.6,44.45
!C1  (via drill 0.81)
  Top 0.406: v118.62,45.72 109.09,36.2 109.09,8.26 OMNIBUS.CH1
  Bottom 0.406: v118.62,45.72 E3.30
!CHAN  (via drill 0.81)
  Top 0.406: v50.04,35.56 29.72,55.88 29.72,158.12 J1.Z
  Bottom 0.406: E3.57 147.83,45.72 145.92,43.81 145.92,35.56 v50.04,35.56
!COL_RED  (via drill 0.81)
  Top 0.406: E3.56 168.78,46.99 168.78,51.44 169.42,52.07 171.32,52.07 171.32,56.52 170.69,57.15 163.7,57.15 v163.7,74.93
  Bottom 0.406: v163.7,74.93 156.72,81.92 53.85,81.92 16.38,119.38 16.38,153.67 18.92,156.21 24,156.21 J1.DD
!DATA0  (via drill 0.81)
  Top 0.406: E3.49 163.7,41.91 v163.7,44.45 | v213.23,44.45 218.31,39.37 218.31,15.88 219.58,14.61 219.58,8.26 OMNIBUS.AR1
  Bottom 0.406: v213.23,44.45 v163.7,44.45
!DATA1  (via drill 0.81)
  Top 0.406: E3.48 164.97,48.26 v164.97,49.53 | v206.25,49.53 216.41,39.37 216.41,8.26 OMNIBUS.AS1
  Bottom 0.406: v206.25,49.53 v164.97,49.53
!DATA2  (via drill 0.81)
  Top 0.406: v194.18,38.1 206.88,25.4 206.88,19.68 210.06,16.51 210.06,8.26 OMNIBUS.AU1
  Bottom 0.406: E3.46 158.62,41.91 182.12,41.91 185.93,38.1 v194.18,38.1
!DATA3  (via drill 0.81)
  Top 0.406: E3.45 159.89,38.1 v159.89,35.56 | v192.28,33.02 206.88,18.41 206.88,8.26 OMNIBUS.AV1
  Bottom 0.406: v159.89,35.56 162.43,33.02 v192.28,33.02
!DATA4
  Top 0.406: E3.37 148.46,39.37 148.46,15.88 149.73,14.61 149.73,8.26 OMNIBUS.BR1
!DATA5
  Top 0.406: E3.36 145.92,41.91 145.92,15.24 146.56,14.61 146.56,8.26 OMNIBUS.BS1
!DATA6
  Top 0.406: E3.35 140.84,36.83 140.84,8.26 OMNIBUS.BU1
!DATA7
  Top 0.406: E3.34 137.67,38.73 137.67,8.26 OMNIBUS.BV1
!DATA8  (via drill 0.81)
  Top 0.406: v17.02,25.4 17.02,8.26 OMNIBUS.DR1
  Bottom 0.406: E3.17 140.84,64.77 125.6,64.77 123.06,62.23 53.85,62.23 v17.02,25.4
!DATA9  (via drill 0.81)
  Top 0.406: E3.16 134.49,63.5 v131.95,66.04 | v13.84,24.13 13.84,8.26 OMNIBUS.DS1
  Bottom 0.406: v131.95,66.04 124.33,66.04 121.79,63.5 53.21,63.5 v13.84,24.13
!DATA10  (via drill 0.81)
  Top 0.406: E3.15 140.84,67.31 140.84,71.12 139.57,72.39 v139.57,73.66 | v28.45,73.66 25.27,70.48 25.27,37.47 7.49,19.68 7.49,8.26 OMNIBUS.DU1
  Bottom 0.406: v28.45,73.66 v139.57,73.66
!DATA11  (via drill 0.81)
  Top 0.406: v4.32,16.51 4.32,8.26 OMNIBUS.DV1
  Bottom 0.406: E3.12 138.3,67.31 123.06,67.31 120.52,64.77 52.58,64.77 v4.32,16.51
!DEL_1  (via drill 0.81)
  Top 0.406: S1.1 74.3,197.61 78.61,197.49 79.88,196.09 79.88,124.46 E15.1 82.42,121.92 82.42,106.68 102.11,106.68 102.74,107.31 102.74,110.49 105.92,110.49 106.55,109.86 106.55,85.72 v130.05,62.23
  Bottom 0.406: E3.84 153.54,64.77 145.29,64.77 142.75,62.23 v130.05,62.23
!DI02  (via drill 0.81)
  Top 0.406: v107.82,193.04 107.82,191.13 110.36,188.59 110.36,177.8 E7.4 111.63,173.99 111.63,151.13 v120.52,142.24 | v175.13,57.15 177.67,59.69 v177.67,85.09
  Bottom 0.406: v107.82,193.04 95.12,193.04 E5.4 | E3.64 171.32,57.15 v175.13,57.15 | v120.52,142.24 v177.67,85.09
!DLY_DONE
  Bottom 0.406: E1.1 224.66,52.07 168.78,52.07 E3.63
!ERASE  (via drill 0.81)
  Top 0.406: E3.58 172.59,50.8 v172.59,74.93
  Bottom 0.406: v172.59,74.93 164.34,83.19 53.85,83.19 17.65,119.38 17.65,153.67 24,153.67 J1.FF
!ERASE_INTERVAL  (via drill 0.81)
  Top 0.406: R14.1 246.25,44.45 246.25,69.85 v239.9,76.2 | v24,116.84 24,146.05 J1.NN
  Bottom 0.406: v239.9,76.2 229.74,76.2 228.47,74.93 181.48,74.93 170.69,85.72 55.12,85.72 v24,116.84
!INTERNAL_IO
  Top 0.406: E3.28 135.76,48.26 135.76,50.16 135.13,50.8 133.86,50.8 131.32,48.26 113.54,48.26 113.54,41.91 99.57,27.94 99.57,8.26 OMNIBUS.CL1
!INTERRUPT  (via drill 0.81)
  Top 0.406: v116.08,52.07 90.04,26.04 90.04,8.26 OMNIBUS.CP1
  Bottom 0.406: E3.27 140.84,52.07 v116.08,52.07
!LD_DEL  (via drill 0.81)
  Top 0.406: v159.89,152.4 E3.81
  Bottom 0.406: v159.89,152.4 163.7,156.21 E4.1
!LOAD_X  (via drill 0.81)
  Top 0.406: E5.16 E5.17 | v186.56,69.85 215.77,99.06 215.77,148.59 216.41,149.22 | E4.3 216.41,149.22 | 216.41,149.22 v164.34,201.29
  Bottom 0.406: E3.77 166.24,69.85 v186.56,69.85 | E5.16 98.3,201.29 v164.34,201.29
!LOAD_Y  (via drill 0.81)
  Top 0.406: v162.43,117.47 E3.79 | E7.16 117.98,177.8 v117.98,156.21
  Bottom 0.406: E7.16 E7.17 | v162.43,117.47 189.74,144.78 218.95,144.78 219.58,145.41 219.58,147.96 | 219.58,147.96 219.58,148.59 E4.4 | v117.98,156.21 123.06,151.13 161.16,151.13 164.34,147.96 219.58,147.96
!MD3  (via drill 0.81)
  Top 0.406: v219.58,26.67 222.76,23.5 222.76,8.26 OMNIBUS.AP1
  Bottom 0.406: E3.50 161.16,44.45 151.64,44.45 151,43.81 151,36.83 150.37,36.83 149.73,36.2 149.73,26.67 v219.58,26.67
!MD4  (via drill 0.81)
  Top 0.406: v163.07,38.1 165.61,35.56 165.61,8.26 OMNIBUS.BK1
  Bottom 0.406: E3.44 156.08,41.91 156.08,39.37 161.8,39.37 v163.07,38.1
!MD5  (via drill 0.81)
  Top 0.406: v161.16,38.1 162.43,36.83 162.43,8.26 OMNIBUS.BL1
  Bottom 0.406: E3.41 154.81,38.1 v161.16,38.1
!MD6  (via drill 0.81)
  Top 0.406: v154.81,25.4 159.26,20.95 159.26,8.26 OMNIBUS.BM1
  Bottom 0.406: E3.40 148.46,41.91 148.46,25.4 v154.81,25.4
!MD7
  Top 0.406: E3.39 149.73,17.78 152.91,14.61 152.91,8.26 OMNIBUS.BP1
!MD8  (via drill 0.81)
  Top 0.406: E3.22 130.68,55.88 v130.68,50.8 | v53.21,36.83 32.89,16.51 32.89,8.26 OMNIBUS.DK1
  Bottom 0.406: v130.68,50.8 128.14,48.26 67.82,48.26 56.39,36.83 v53.21,36.83
!MD9  (via drill 0.81)
  Top 0.406: v29.72,19.05 29.72,8.26 OMNIBUS.DL1
  Bottom 0.406: E3.21 140.84,57.15 67.82,57.15 v29.72,19.05
!MD10  (via drill 0.81)
  Top 0.406: v26.54,17.78 26.54,8.26 OMNIBUS.DM1
  Bottom 0.406: E3.20 67.18,58.42 v26.54,17.78
!MD11  (via drill 0.81)
  Top 0.406: v22.73,17.78 20.19,15.24 20.19,8.26 OMNIBUS.DP1
  Bottom 0.406: E3.18 65.91,60.96 v22.73,17.78
!NON_STORE  (via drill 0.81)
  Top 0.406: E3.80 161.16,69.85 v161.16,87
  Bottom 0.406: v161.16,87 141.48,106.68 36.07,106.68 18.92,123.83 18.92,125.09 22.1,128.27 24,128.27 24,148.59 J1.LL
!PAUSE  (via drill 0.81)
  Top 0.406: v125.6,36.83 118.62,29.84 118.62,8.26 OMNIBUS.CD1
  Bottom 0.406: E3.33 138.3,36.83 v125.6,36.83
!SKIP  (via drill 0.81)
  Top 0.406: v86.23,53.34 83.69,50.8 83.69,8.26 OMNIBUS.CS1
  Bottom 0.406: v86.23,53.34 E3.24
!WRITE_THRU  (via drill 0.81)
  Top 0.406: v175.13,50.8 178.94,54.61 v178.94,74.93 | v27.81,111.12 27.81,149.86 J1.JJ
  Bottom 0.406: v175.13,50.8 E3.60 | v178.94,74.93 169.42,84.45 54.48,84.45 v27.81,111.12
+15V  (via drill 0.81)
  Top 0.406: E8.8 102.74,175.26 102.74,180.34 E7.18 | E6.8 87.5,190.5 87.5,195.58 E5.18 | v58.29,15.88 v58.29,18.41 | v54.48,184.15 54.48,35.56 C28.1
  Bottom 0.406: E7.18 104.01,186.69 88.77,186.69 86.87,188.59 | E6.8 86.87,188.59 | C28.1 53.21,20.32 C43.+ v58.29,18.41 | v58.29,15.88 58.29,8.26 OMNIBUS.DA2 | 86.87,188.59 82.42,184.15 v54.48,184.15
-15V  (via drill 0.81)
  Top 0.686: C25.2 190.37,36.2 189.1,34.92 v189.1,24.13 v189.1,15.88 | v251.97,20.95 v257.05,15.88 | v177.67,158.75 185.29,151.13 C24.-
  Bottom 0.686: E6.4 107.82,181.61 111.63,177.8 114.81,177.8 115.44,177.16 115.44,166.37 | E8.4 115.44,166.37 | C24.- C25.2 | v189.1,15.88 187.83,14.61 187.83,8.26 OMNIBUS.BB2 | OMNIBUS.CB2 124.97,8.26 124.97,24.13 v189.1,24.13 248.79,24.13 v251.97,20.95 | v257.05,15.88 257.68,15.88 257.68,8.26 OMNIBUS.AB2 | 115.44,166.37 117.98,163.83 172.59,163.83 v177.67,158.75
BTP3  (via drill 0.81)
  Top 0.406: v182.75,39.37 187.83,39.37 187.83,69.85 217.04,99.06 217.04,144.78 E4.5
  Bottom 0.406: E15.5 79.88,114.3 79.88,124.46 89.41,124.46 93.85,128.91 93.85,135.89 109.73,135.89 119.89,146.05 E4.5 | E3.51 166.24,39.37 v182.75,39.37
COLOR
  Top 0.406: D2.A R8.1 | E2.10 232.28,73.66 232.28,81.28 E2.1
  Bottom 0.406: D2.A 219.58,116.84 219.58,93.98 E2.1
D00
  Top 0.406: E3.2 156.08,69.85 156.08,198.75 152.91,201.93 58.29,201.93 J2.B
  Bottom 0.406: J2.B RN1.2 C16.1
D01  (via drill 0.81)
  Top 0.406: v64.64,80.01 62.1,82.55 62.1,181.61 J2.D
  Bottom 0.406: E3.4 151,69.85 151,80.01 v64.64,80.01 | J2.D RN1.3 C17.1
D02  (via drill 0.81)
  Top 0.406: E3.5 148.46,72.39 v148.46,158.75
  Bottom 0.406: v148.46,158.75 144.65,162.56 97.03,162.56 84.96,174.62 84.96,182.88 83.06,182.88 81.79,181.61 72.26,181.61 70.99,182.88 C18.1 RN1.4 J2.F
D03  (via drill 0.81)
  Top 0.406: v64.64,78.11 60.83,81.92 60.83,177.8 J2.J
  Bottom 0.406: E3.6 148.46,69.85 148.46,78.11 v64.64,78.11 | J2.J RN1.5 C19.1
D08  (via drill 0.81)
  Top 0.406: v58.29,69.85 58.29,137.79 59.56,139.06 59.56,166.37 J2.V
  Bottom 0.406: E3.8 145.92,69.85 145.92,72.39 130.68,72.39 129.41,71.12 123.7,71.12 121.16,68.58 59.56,68.58 v58.29,69.85 | J2.V 59.56,168.91 59.56,172.72 RN1.6 C20.1
D09  (via drill 0.81)
  Top 0.406: v58.93,67.31 57.02,69.22 57.02,163.83 J2.X
  Bottom 0.406: E3.9 143.38,69.85 124.33,69.85 121.79,67.31 v58.93,67.31 | J2.X 60.83,167.64 60.83,171.45 RN1.7 C21.1
D10  (via drill 0.81)
  Top 0.406: E3.10 143.38,69.85 v143.38,147.32
  Bottom 0.406: v143.38,147.32 140.84,149.86 113.54,149.86 105.92,157.48 60.2,157.48 58.93,158.75 57.66,158.75 57.02,159.38 57.02,161.29 J2.Z 62.1,166.37 62.1,170.18 RN1.8 C22.1
D11  (via drill 0.81)
  Top 0.406: E3.11 140.84,72.39 140.84,157.48 v139.57,158.75
  Bottom 0.406: v139.57,158.75 138.3,160.02 63.37,160.02 | J2.BB 63.37,160.02 | 63.37,160.02 63.37,168.91 RN1.9 C23.1
DEL_1
  Top 0.406: E15.6 78.61,113.03 78.61,194.31 S1.3
DI03  (via drill 0.81)
  Top 0.406: v97.66,180.34 96.39,181.61 E5.5 | v149.73,57.15 145.92,60.96 v145.92,119.38 | v120.52,144.78 112.9,152.4 112.9,175.26 E7.5
  Bottom 0.406: E7.5 108.46,179.71 103.38,179.71 102.74,180.34 v97.66,180.34 | E3.65 166.24,57.15 v149.73,57.15 | v120.52,144.78 v145.92,119.38
DI04  (via drill 0.81)
  Top 0.406: v100.2,179.07 98.93,180.34 E5.6 | v134.49,59.69 121.79,72.39 121.79,150.5 114.17,158.12 E7.6
  Bottom 0.406: E7.6 112.9,175.26 103.38,175.26 102.74,175.9 102.74,179.07 v100.2,179.07 | E3.67 144.02,58.42 142.75,59.69 v134.49,59.69
DI05  (via drill 0.81)
  Top 0.406: E3.68 171.32,62.23 v171.32,170.81
  Bottom 0.406: E7.7 117.98,177.8 121.16,177.8 121.79,178.44 121.79,179.07 | 121.79,179.07 121.79,182.88 118.62,182.88 117.98,183.51 117.98,190.5 102.74,190.5 E5.7 | v171.32,170.81 163.07,179.07 121.79,179.07
DI06  (via drill 0.81)
  Top 0.406: E7.8 119.25,179.71 115.44,183.51 115.44,187.32 108.46,194.31 104.01,194.31 E5.8 | v173.86,62.23 176.4,64.77 v176.4,161.93
  Bottom 0.406: E3.69 168.78,62.23 v173.86,62.23 | v176.4,161.93 163.07,175.26 120.52,175.26 E7.8
DI07  (via drill 0.81)
  Top 0.406: E7.9 120.52,177.8 v120.52,179.07 | v109.09,182.25 107.82,183.51 107.82,189.87 106.55,191.13 E5.9 | v173.86,166.37 v173.86,64.77
  Bottom 0.406: v120.52,179.07 117.35,182.25 v109.09,182.25 | E3.70 171.32,64.77 v173.86,64.77 | v173.86,166.37 162.43,177.8 123.06,177.8 E7.9
DI08  (via drill 0.81)
  Top 0.406: E7.10 125.6,177.8 v125.6,191.77 | E3.73 168.78,67.31 168.78,183.51 v160.53,191.77
  Bottom 0.406: E5.10 v125.6,191.77 v160.53,191.77
DI09  (via drill 0.81)
  Top 0.406: E5.11 123.06,185.42 | 123.06,185.42 E7.11 | v170.05,107.95 E3.74 | v133.22,144.78 123.06,154.94 123.06,185.42
  Bottom 0.406: v133.22,144.78 v170.05,107.95
DI10  (via drill 0.81)
  Top 0.406: E5.12 E7.12 | v167.51,180.34 E3.75
  Bottom 0.406: v167.51,180.34 164.97,182.88 123.06,182.88 E7.12
DI11  (via drill 0.81)
  Top 0.406: E7.13 116.71,186.69 116.71,187.32 104.65,199.39 E5.13 | E3.76 166.24,69.85 v166.24,184.15
  Bottom 0.406: v166.24,184.15 164.97,185.42 120.52,185.42 E7.13
GND  (via drill 0.81)
  Top 0.686: C6.2 C64.2 82.42,149.86 R86.1 | J2.KK J2.MM | J2.K J2.H J2.E J2.C | J1.HH 22.73,153.67 | 22.73,153.67 J1.EE J1.CC J1.AA | J1.E J1.C | J1.K 22.73,176.53 | 22.73,176.53 J1.M | C65.2 C8.2 106.55,157.48 E8.3 109.09,168.91 E8.5 E7.3 E7.2 | C7.2 91.31,172.72 E6.3 93.85,184.15 E6.5 | E5.14 E5.15 E5.3 E5.2 | 245.62,16.51 Q1.1 250.06,22.86 255.14,27.94 255.14,39.37 C13.- | 245.62,16.51 245.62,8.26 OMNIBUS.AF2 | C4.2 219.58,142.24 E4.7 228.47,130.81 228.47,85.09 | E2.9 232.28,64.77 | 232.28,64.77 E2.8 228.47,67.31 228.47,85.09 | 228.47,85.09 C2.2 | 232.28,64.77 232.28,50.8 | 232.28,50.8 C1.2 232.28,29.21 E1.8 226.57,23.5 226.57,16.51 | 226.57,16.51 v226.57,15.88 226.57,8.26 OMNIBUS.AN2 | 226.57,16.51 245.62,16.51 | v80.52,15.88 80.52,8.26 OMNIBUS.CT2 | v92.58,15.88 92.58,8.26 OMNIBUS.CN1 | v111.63,16.51 111.63,8.26 OMNIBUS.CF1 | C43.- 55.75,38.1 55.75,27.3 51.94,23.5 51.94,15.24 | 51.94,15.24 51.94,8.26 OMNIBUS.DC1 | 51.94,15.24 43.05,15.24 42.42,14.61 42.42,8.26 OMNIBUS.DF2 | v10.67,15.88 10.67,8.26 OMNIBUS.DT2 | v22.73,15.88 22.73,8.26 OMNIBUS.DN2 | v144.02,15.88 144.02,8.26 OMNIBUS.BT2 | E3.32 C11.2 | C15.- 126.87,27.94 121.79,22.86 v121.79,15.88 121.79,8.26 OMNIBUS.CC1 | E3.59 166.24,49.53 166.24,50.8 164.34,50.8 158.62,45.09 158.62,41.91 E3.47 161.16,39.37 175.13,39.37 175.13,38.1 | 175.13,24.13 175.13,8.26 OMNIBUS.BF2 | 175.13,24.13 175.13,38.1 | 175.13,24.13 v183.39,15.88 184.66,14.61 184.66,8.26 OMNIBUS.BC1 | C9.2 E3.7 148.46,69.85 148.46,60.33 152.27,56.52 E3.42 151,41.91 C10.2 151,23.5 156.08,18.41 156.08,8.26 OMNIBUS.BN2 | C25.1 192.91,36.83 192.91,40.64 | C5.2 192.91,45.09 | 192.91,45.09 192.91,40.64
  Top 0.686: 192.91,40.64 204.98,40.64 | 204.98,40.64 C14.- 213.23,38.1 213.23,8.26 OMNIBUS.AT2 | 175.13,38.1 189.1,38.1 189.1,41.27 192.91,45.09 | 232.28,50.8 204.98,50.8 204.98,40.64 | RN1.10 63.37,168.91 v63.37,193.04 | C23.2 C22.2 C21.2 C20.2 C19.2 C18.2 C17.2 C16.2 | Y.1@2 J1.S | 22.73,176.53 X.1@1 | 22.73,153.67 Z.1@2
  Bottom 0.686: E15.7 78.61,110.49 78.61,124.46 | 78.61,124.46 78.61,125.73 C6.2 | 78.61,124.46 C3.2 | J2.C J2.A 60.83,193.04 v63.37,193.04 87.5,193.04 E5.2 | J2.K J2.M J2.P J2.S J2.U J2.W J2.Y J2.AA J2.CC J2.EE J2.HH J2.KK | J2.MM J2.PP | J1.AA J1.Y J1.W J1.U | J1.AA J1.BB | J1.PP J1.MM J1.KK J1.HH | J1.A 22.73,186.69 | 22.73,186.69 J1.C | J1.H J1.E J1.F | J1.H J1.J J2.H | J1.N J1.M J1.P J1.S J1.U | J1.U J1.V | J1.K J1.H | ISP.10 145.29,197.49 145.29,198.12 | 145.29,198.12 145.29,200.03 157.35,200.03 159.26,198.12 159.26,195.58 | ISP.2 159.26,195.58 | E7.14 E7.15 109.09,189.23 E6.5 E5.3 | 145.29,198.12 102.74,198.12 E5.14 | E8.3 105.28,165.1 96.39,165.1 C7.2 | R86.1 84.96,149.86 98.3,149.86 100.84,147.32 106.55,147.32 C65.2 | 225.3,15.24 213.87,15.24 213.87,8.26 OMNIBUS.AT2 | 225.3,15.24 225.93,14.61 225.93,8.26 OMNIBUS.AN2 | 244.98,15.24 244.98,8.26 OMNIBUS.AF2 | 225.3,15.24 226.57,15.24 | 226.57,15.24 244.98,15.24 | 244.98,15.24 254.51,15.24 254.51,8.26 OMNIBUS.AC2 | v226.57,15.88 226.57,15.24 | 80.52,15.24 80.52,8.26 OMNIBUS.CT2 | 80.52,15.24 v80.52,15.88 76.71,19.68 61.47,19.68 58.93,17.14 48.77,17.14 | 91.95,15.24 80.52,15.24 | 91.95,15.24 92.58,14.61 92.58,8.26 OMNIBUS.CN1 | 91.95,15.24 v92.58,15.88 93.22,16.51 v111.63,16.51 111.63,15.24 | 111.63,15.24 111.63,8.26 OMNIBUS.CF1 | 121.16,15.24 121.16,8.26 OMNIBUS.CC1 | 111.63,15.24 121.16,15.24 | C43.- C28.2 48.77,36.2 48.77,17.14 | 10.67,15.24 10.67,8.26 OMNIBUS.DT2 | 10.67,15.24 v10.67,15.88 | 22.1,15.24 10.67,15.24 | 22.1,15.24 22.73,14.61 22.73,8.26 OMNIBUS.DN2 | 22.1,15.24 v22.73,15.88 | 41.78,15.24 41.78,8.26 OMNIBUS.DF2 | 22.1,15.24 41.78,15.24 | 41.78,15.24 48.77,15.24
  Bottom 0.686: 48.77,15.24 51.31,15.24 51.31,8.26 OMNIBUS.DC1 | 48.77,15.24 48.77,17.14 | 144.02,15.24 144.02,8.26 OMNIBUS.BT2 | 144.02,15.24 v144.02,15.88 | 144.02,15.24 155.45,15.24 156.08,14.61 | 156.08,14.61 156.08,8.26 OMNIBUS.BN2 | 185.29,15.24 185.29,8.26 OMNIBUS.BC1 | 185.29,15.24 C24.+ | 175.77,15.24 175.77,8.26 OMNIBUS.BF2 | 185.29,15.24 183.39,15.24 | 183.39,15.24 175.77,15.24 | 156.08,14.61 156.72,15.24 175.77,15.24 | C15.- 129.41,43.18 C11.2 | E3.32 140.84,41.91 142.75,41.91 143.38,42.55 143.38,48.26 E3.59 | v183.39,15.88 183.39,15.24 | E3.19 165.61,60.96 166.88,59.69 173.23,59.69 175.13,61.59 | 175.13,61.59 C12.2 E3.72 168.78,67.31 161.16,67.31 E3.82 | 175.13,61.59 180.85,55.88 C5.2 | C10.2 152.27,36.83 187.83,36.83 C25.1 | v121.79,15.88 121.16,15.24 | 159.26,195.58 196.09,158.75 C4.2 | RN1.10 72.26,167.64 C23.2 | X.1 X.1@2 22.73,186.69 | Z.1@2 Z.1 Z.1@1 | Y.1@2 Y.1 | J1.AA Y.1@1
GRN_DELAY
  Top 0.406: TP2.TP 247.52,186.69 247.52,87 239.27,78.74 237.36,78.74 237.36,76.2 E2.13
  Bottom 0.406: E3.1 157.35,73.66 236.73,73.66 238,74.93 E2.13
INITIALIZE
  Top 0.406: E3.25 140.84,52.07 133.73,52.07 131.95,50.16 131.32,49.53 119.89,49.53 117.35,52.7 116.71,53.34 87.5,53.34 87.5,15.24 86.87,14.61 86.87,8.26 OMNIBUS.CR1
INTENS  (via drill 0.81)
  Top 0.406: C63.1 R79.1 R78.1 | S1.2 77.34,193.04 v77.34,147.32
  Bottom 0.406: v77.34,147.32 81.15,143.51 106.55,143.51 R78.1
N$1
  Top 0.406: E6.2 88.77,179.71 84.33,175.26 82.42,175.26 82.42,186.69 C41.2
  Bottom 0.406: E5.1 83.69,189.23 C41.2
N$2
  Top 0.406: R3.1 R5.1 R2.2 95.12,180.34 95.12,190.5 92.58,190.5 E6.6
N$3
  Top 0.406: R2.1 C41.1 84.96,181.61 | 84.96,181.61 E6.1 | E5.20 84.96,198.12 84.96,181.61
N$4
  Bottom 0.406: C39.1 231.01,195.58 S2.1
N$5
  Bottom 0.406: E8.2 104.01,172.72 100.2,172.72 | C42.2 100.2,172.72 | E7.1 100.2,175.26 100.2,172.72
N$6
  Top 0.406: R11.1 R12.1 R6.2
  Bottom 0.406: E8.6 106.55,167.64 107.19,167.64 107.82,167 107.82,163.83 R6.2
N$7
  Top 0.406: R6.1 C42.1 100.2,166.37 | 100.2,166.37 E8.1 | E7.20 101.47,178.44 100.2,177.16 100.2,166.37
N$27  (via drill 0.81)
  Top 0.406: D1.A 105.28,80.01 v129.41,55.88
  Bottom 0.406: v129.41,55.88 130.68,54.61 163.7,54.61 E3.61
N$28
  Top 0.406: R18.1 D1.C
  Bottom 0.406: E15.11 C40.1 98.93,120.65 R18.1
N$29
  Bottom 0.406: E15.10 90.04,114.3 C40.2
N$30
  Top 0.406: R19.1 248.79,99.06 C34.2
  Bottom 0.406: C34.2 246.25,80.01 E2.15 237.36,78.74 223.39,78.74 222.12,77.47 | 222.12,77.47 C35.2 | 222.12,77.47 C35A.2
N$31
  Bottom 0.406: R20.1 215.77,67.31 E2.7 232.28,66.04 253.87,66.04 C33.2
N$32
  Bottom 0.406: E2.6 232.28,71.12 246.25,71.12 252.6,77.47 C33.1
N$33
  Top 0.406: E2.14 241.17,77.47 C34.1
  Bottom 0.406: C34.1 223.39,68.58 222.12,69.85 | 222.12,69.85 C35.1 | 222.12,69.85 C35A.1
N$35
  Bottom 0.406: E1.13 232.92,38.1 231.65,39.37 193.55,39.37 189.74,43.18 E3.54
N$36
  Bottom 0.406: E1.15 250.06,43.18 250.7,43.81 | C36.2 250.7,43.81 | 250.7,43.81 R4.1
N$37
  Bottom 0.406: E1.14 237.36,41.91 237.36,44.45 C36.1
N$38
  Bottom 0.406: Q1.2 251.97,30.48 R14.2
N$39
  Top 0.406: 247.52,27.94 E1.9 | R15.1 247.52,27.94 | Q1.3 247.52,27.3 247.52,27.94
N$40
  Top 0.406: E1.11 E1.10 R22.1
N$41
  Top 0.406: R7.1 C37.2 E1.7
N$42
  Bottom 0.406: C37.1 228.47,33.02 E1.6
N$44
  Top 0.406: R9.1 194.18,144.78 D2.C
  Bottom 0.406: W3.1 209.42,153.67 195.45,153.67 D2.C
N$45
  Top 0.406: W3.2 W4.1 | S2.2 227.2,181.61 227.2,149.86 E4.11
  Bottom 0.406: E4.11 219.58,142.24 W3.2
N$46
  Top 0.406: R10.1 206.88,148.59 W4.2
N$48
  Top 0.406: C38.1 237.36,158.75 244.98,166.37 244.98,194.31 S2.3
N$49
  Top 0.406: C39.2 237.36,143.51 C38.2
  Bottom 0.406: E4.10 228.47,143.51 C39.2
N$153
  Top 0.406: Q31.2 117.98,135.89 R79.2
N$154
  Top 0.406: C63.2 109.09,137.16 109.09,142.88 103.38,148.59 Q14.2
  Bottom 0.406: Q31.3 C63.2 | Q14.2 101.47,154.94 95.12,154.94 R84.2
N$155  (via drill 0.81)
  Top 0.686: R84.1 R85.1 | v76.07,149.86 65.91,139.7 65.91,35.56 54.48,24.13 v54.48,15.88
  Bottom 0.686: R85.1 79.88,149.86 v76.07,149.86 | v54.48,15.88 54.48,8.26 OMNIBUS.DB2
N$156
  Top 0.406: C65.1 Q14.3
  Bottom 0.406: R85.2 96.39,151.13 Q14.3
N$157
  Top 0.406: Q13.1 R87.1 R86.2
  Bottom 0.406: Q14.1 96.39,148.59 R87.1
N$158
  Top 0.406: R80.2 W5.1
N$159
  Top 0.406: R81.2 W8.1
N$160
  Top 0.406: R83.2 91.31,135.89 Q13.2
N$161
  Top 0.406: W8.2 W5.2
  Bottom 0.406: R83.1 102.74,129.54 W8.2
N$162
  Top 0.406: R82.1 93.85,135.89 Q13.3
  Bottom 0.406: Q13.3 C64.1
RED_DELAY
  Top 0.406: TP1.TP 246.25,190.5 246.25,97.16 232.92,83.82 229.74,83.82 229.74,73.66 E2.5
  Bottom 0.406: E3.83 158.62,72.39 E2.5
SET_DONE  (via drill 0.81)
  Top 0.406: v166.24,46.99 164.97,45.72 E3.52
  Bottom 0.406: E1.5 232.28,36.83 239.27,36.83 239.9,37.47 239.9,39.37 234.19,39.37 231.65,41.91 217.68,41.91 212.6,46.99 v166.24,46.99
TCK
  Top 0.406: E3.62 168.78,54.61 158.62,54.61 158.62,196.85 ISP.1
TDI  (via drill 0.81)
  Top 0.406: v137.03,66.04 137.03,187.96 ISP.9
  Bottom 0.406: v137.03,66.04 E3.14
TDO  (via drill 0.81)
  Top 0.406: v152.27,63.5 151,64.77 151,192.41 153.54,194.94 153.54,196.85 ISP.3
  Bottom 0.406: v152.27,63.5 E3.71
TMS
  Top 0.406: E3.23 140.84,57.15 140.84,64.14 140.21,64.77 138.3,64.77 138.3,182.25 151,194.94 151,196.85 ISP.5
TP3  (via drill 0.81)
  Top 0.406: v123.7,46.99 110.36,33.66 v110.36,15.24
  Bottom 0.406: E3.29 140.84,46.99 v123.7,46.99 | v110.36,15.24 109.73,15.24 109.09,14.61 109.09,8.26 OMNIBUS.CH2
VCC  (via drill 0.81)
  Top 0.686: E7.19 102.74,185.42 102.74,200.66 90.04,200.66 E5.19 87.5,200.66 81.79,200.66 81.79,198.75 | 83.69,172.72 R3.2 R11.2 C8.1 97.66,154.94 97.66,127 | 83.69,172.72 C7.1 | C3.1 22.73,127 J1.UU | R80.1 R81.1 117.98,130.81 | 117.98,130.81 117.98,134.62 119.25,135.89 Q31.1 | C6.1 E15.14 90.04,121.92 90.04,119.38 | R18.2 90.04,107.95 90.04,119.38 | 90.04,119.38 97.66,127 | 97.66,127 101.47,130.81 | 101.47,130.81 R82.2 | 101.47,130.81 117.98,130.81 | 81.79,198.75 81.79,187.32 81.15,186.69 81.15,175.26 83.69,172.72 | J3.1 128.78,41.91 v128.78,22.23 | J4.1 153.54,33.66 v153.54,22.86 | R7.2 E1.3 E1.2 | R4.2 247.52,36.83 R15.2 R22.2 E1.16 C1.1 239.9,49.53 239.9,68.58 E2.11 236.09,72.39 236.09,80.01 E2.16 C2.1 | C5.1 213.23,69.85 R20.2 | C4.1 E4.14 | R8.2 R9.2 R10.2 | E2.2 E2.3 | RN1.1 69.09,194.94 69.09,196.85 70.99,198.75 81.79,198.75
  Bottom 0.686: ISP.4 152.91,193.68 109.09,193.68 105.92,196.85 91.31,196.85 E5.19 | J1.UU J1.SS | Q31.1 119.25,142.24 R78.2 | C3.1 22.73,127 55.75,127 | 55.75,127 87.5,127 C6.1 | 192.28,16.51 191.64,15.88 191.64,8.26 OMNIBUS.BA2 | 192.28,16.51 195.45,19.68 210.06,19.68 C14.+ 211.33,19.68 260.86,19.68 | OMNIBUS.CA2 127.51,8.26 127.51,20.32 C15.+ v128.78,22.23 152.91,22.23 v153.54,22.86 185.93,22.86 192.28,16.51 | R4.2 253.87,22.86 C13.+ 260.86,22.86 260.86,19.68 | E1.2 233.55,45.72 E1.16 | 260.86,19.68 260.86,8.26 OMNIBUS.AA2 | E4.14 224.66,157.48 222.76,157.48 | R10.2 222.76,157.48 | R19.2 C2.1 238.63,139.06 227.84,149.86 222.76,149.86 222.76,157.48 | E2.16 233.55,82.55 E2.2 229.74,81.28 214.5,81.28 R20.2 | R11.2 107.19,158.75 108.46,157.48 R8.2 | J2.SS J2.UU 55.75,127
VCCINT
  Top 0.686: C9.1 153.54,72.39 E3.3 153.54,69.85 153.54,41.91 E3.43 J4.2 157.35,36.2 C10.1
VCCIO
  Top 0.686: C11.1 134.49,48.26 135.13,47.62 J3.2 143.38,46.99 | 143.38,46.99 E3.38 | E3.13 143.38,67.31 143.38,46.99 | E3.53 166.24,41.91 166.24,43.81 166.88,44.45 173.86,44.45 173.86,58.42 C12.1 | E3.78 166.24,67.31 166.24,60.33 166.88,59.69 170.05,59.69 E3.66
  Bottom 0.686: E3.26 138.3,49.53 C11.1 | E3.66 173.86,58.42 C12.1 | E3.13 143.38,67.31 152.91,67.31 153.54,67.94 153.54,69.85 163.7,69.85 E3.78
X_ANALOG
  Top 0.406: R5.2 87.5,180.34 87.5,187.96 E6.7
  Bottom 0.406: X.2 12.57,184.15 24,184.15 J1.D 29.08,181.61 69.09,181.61 71.63,179.07 81.15,179.07 R5.2
Y_ANALOG
  Top 0.406: R12.2 102.74,165.1 102.74,172.72 E8.7
  Bottom 0.406: Y.2 21.46,176.53 24,176.53 J1.L 26.54,179.07 69.09,179.07 71.63,176.53 75.44,176.53 90.68,161.29 R12.2
Z_AXIS
  Bottom 0.406: R87.2 41.78,148.59 31.62,158.75 | J1.X 31.62,158.75 | Z.2 20.19,158.75 31.62,158.75

### Text on the board
Top: + | + | + | + | +
Bottom: SIDE 2 | Space War | VC8E+Input